# Altium project Project Board Module AM625.PrjPCB (part 2 of 2)

## Sheet SOC-Bootstrap.SchDoc
size A3; DocumentNumber: 9; SheetNumber: 10; SheetTotal: 14
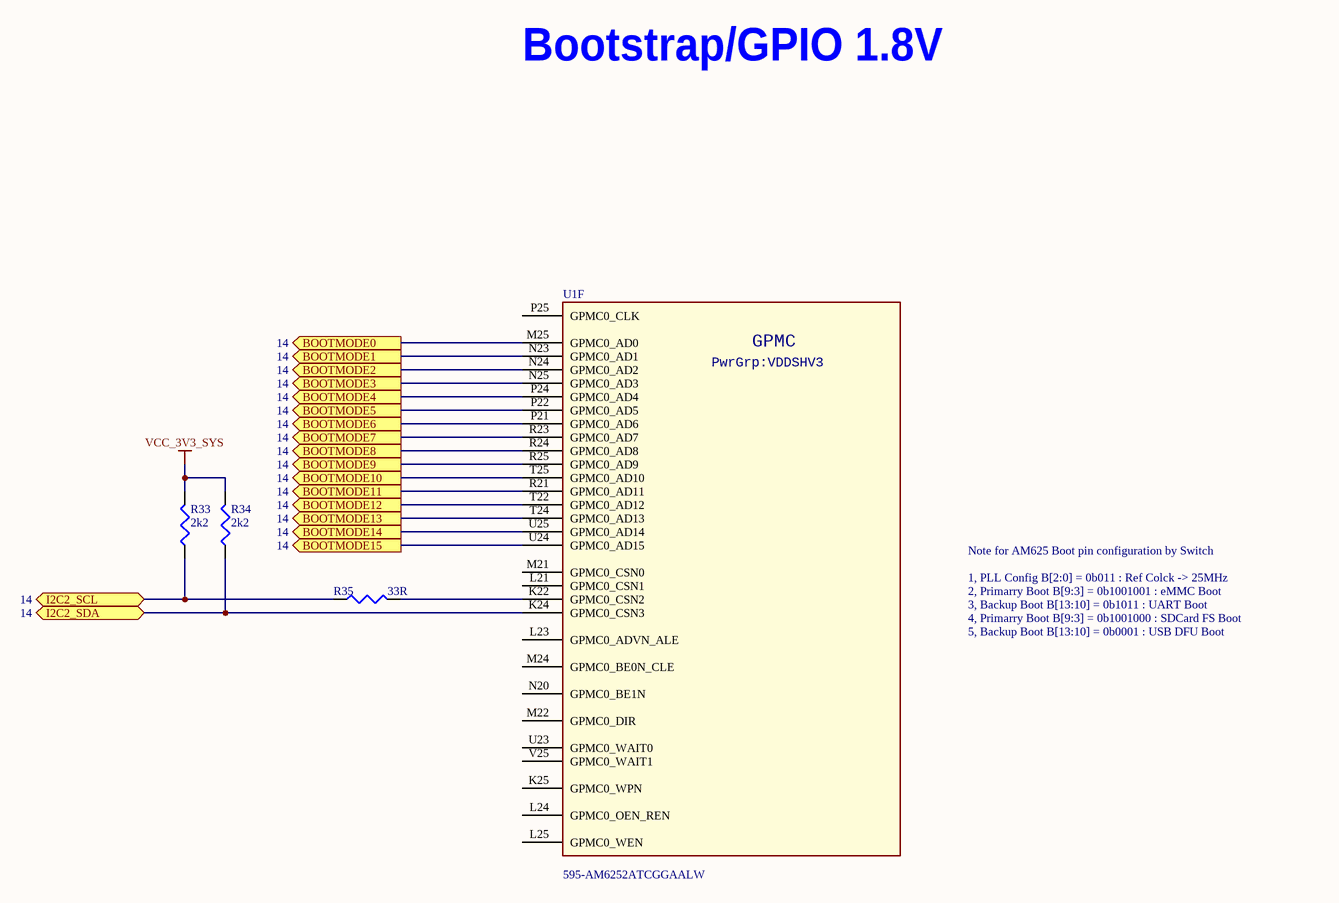
[diagram p5: SOC-Bootstrap.SchDoc]

### Parts
R33  2k2  [R0402]
R34  2k2  [R0402]
R35  33R  [R0201]
U1  Supplier Part Number 1: 595-AM6252ATCGGAALW  [BGA425C50P25X25_1300X1300X89]  (hidden comment: AM62-EVM_BGA425)  (part F of 18)

### Ports
BOOTMODE0 (out, see 14), BOOTMODE1 (out, see 14), BOOTMODE2 (out, see 14), BOOTMODE3 (out, see 14), BOOTMODE4 (out, see 14), BOOTMODE5 (out, see 14), BOOTMODE6 (out, see 14), BOOTMODE7 (out, see 14), BOOTMODE8 (out, see 14), BOOTMODE9 (out, see 14), BOOTMODE10 (out, see 14), BOOTMODE11 (out, see 14), BOOTMODE12 (out, see 14), BOOTMODE13 (out, see 14), BOOTMODE14 (out, see 14), BOOTMODE15 (out, see 14), I2C2_SCL (bidir, see 14), I2C2_SDA (bidir, see 14)

### Nets
VCC_3V3_SYS: R33.2 R34.2
BOOTMODE0: U1.M25(GPMC0_AD0) ; port BOOTMODE0
BOOTMODE1: U1.N23(GPMC0_AD1) ; port BOOTMODE1
BOOTMODE2: U1.N24(GPMC0_AD2) ; port BOOTMODE2
BOOTMODE3: U1.N25(GPMC0_AD3) ; port BOOTMODE3
BOOTMODE4: U1.P24(GPMC0_AD4) ; port BOOTMODE4
BOOTMODE5: U1.P22(GPMC0_AD5) ; port BOOTMODE5
BOOTMODE6: U1.P21(GPMC0_AD6) ; port BOOTMODE6
BOOTMODE7: U1.R23(GPMC0_AD7) ; port BOOTMODE7
BOOTMODE8: U1.R24(GPMC0_AD8) ; port BOOTMODE8
BOOTMODE9: U1.R25(GPMC0_AD9) ; port BOOTMODE9
BOOTMODE10: U1.T25(GPMC0_AD10) ; port BOOTMODE10
BOOTMODE11: U1.R21(GPMC0_AD11) ; port BOOTMODE11
BOOTMODE12: U1.T22(GPMC0_AD12) ; port BOOTMODE12
BOOTMODE13: U1.T24(GPMC0_AD13) ; port BOOTMODE13
BOOTMODE14: U1.U25(GPMC0_AD14) ; port BOOTMODE14
BOOTMODE15: U1.U24(GPMC0_AD15) ; port BOOTMODE15
I2C2_SCL: R33.1 R35.1 ; port I2C2_SCL
I2C2_SDA: R34.1 U1.K24(GPMC0_CSN3) ; port I2C2_SDA
NetR35_2: R35.2 U1.K22(GPMC0_CSN2)

Not connected (* = marked no-connect by the designer): U1 K25(GPMC0_WPN) L21(GPMC0_CSN1) L23(GPMC0_ADVN_ALE) L24(GPMC0_OEN_REN) L25(GPMC0_WEN) M21(GPMC0_CSN0) M22(GPMC0_DIR) M24(GPMC0_BE0N_CLE) N20(GPMC0_BE1N) P25(GPMC0_CLK) U23(GPMC0_WAIT0) V25(GPMC0_WAIT1)

### Notes on the sheet
- Bootstrap/GPIO 1.8V
- Note for AM625 Boot pin configuration by Switch
- 1, PLL Config B[2:0] = 0b011 : Ref Colck -> 25MHz
- 2, Primarry Boot B[9:3] = 0b1001001 : eMMC Boot
- 3, Backup Boot B[13:10] = 0b1011 : UART Boot
- 4, Primarry Boot B[9:3] = 0b1001000 : SDCard FS Boot
- 5, Backup Boot B[13:10] = 0b0001 : USB DFU Boot
- (in symbol AM62-EVM_BGA425, part F) GPMC; PwrGrp:VDDSHV3

### Library data of the parts
R33 R34 = RC0402FR-072K2L: RES 2.20K OHM 1/16W 1% 0402 SMD; Manufacturer: Yageo; Resistance (Ohms): 2.2K; Power (Watts): 0.063W, 1/16W; .Checked PCB: used; Temperature Coefficient: ±100ppm/°C; Category: Resistors; Supplier Part Number: 311-2.20KLRCT-ND; Manufacturer Part Number: RC0402FR-072K2L; Package / Case: 0402 (1005 Metric); Price 1k [$]: 0.01421; Tolerance: ±1%; Value: 2k2; .Checked SCH: used; Supplier: Digikey; Supplier 1: Digi-Key; Supplier Part Number 1: 311-2.20KLRCT-ND; RoHS: RoHS Compliant; Stock 1: 195154; Pricing 1: 10=0.014, 50=0.0104, 100=0.0079, 250=0.00584, 500=0.00432, 1000=0.00288 (USD); Composition: Thick Film; Features: -; Size / Dimension: 0.039" L x 0.020" W (1.00mm x 0.50mm); Height: 0.016" (0.40mm); Number of Terminations: 2; Packaging: Cut Tape (CT); ComponentLink1URL: http://www.yageo.com/documents/recent/PYu-RC0402_51_RoHS_L_6.pdf; ComponentLink1Description: http://www.yageo.com/documents/recent/PYu-RC0402_51_RoHS_L_6.pdf
R35 = RC0201FR-0733RL: RES 33 OHM 1% 1/20W 0201; Manufacturer: Yageo; Power Rating: 50mW; Voltage Rating: 25V; Temperature Coefficient: 200ppm/°C; Supplier 1: Digi-Key; Manufacturer Part Number: RC0201FR-0733RL; Stock 1: 4610000; Pricing 1: 10000=0.0053, 50000=0.0042, 100000=0.0038 (USD); Case/Package: 0201; Case Code (Metric): 0603; Case Code (Imperial): 0201; Size Code: 0201; Min Operating Temperature: -55°C; Max Operating Temperature: 125°C; Resistance: 33R; Tolerance: 1%; Package Quantity: 1; Packaging: Cut Tape; Resistor Type: Thick Film; Number of Terminations: 2; Termination: SMD/SMT; Max Power Dissipation: 50mW; Features: Moisture Resistant; Series: RC; Resistance Tolerance: 1%; Length: 0.024inch; Width: 0.012inch; Height: 0.01inch; Lead Free: Lead Free; RoHS Compliant: Yes; ComponentLink1URL: https://datasheet.ciiva.com/7672/1563626-7672223.pdf?src-supplier=Element14; ComponentLink1Description: https://datasheet.ciiva.com/7672/1563626-7672223.pdf?src-supplier=Element14; ComponentLink2URL: https://datasheet.ciiva.com/22698/1563626-22698520.pdf?src-supplier=Element14; ComponentLink2Description: https://datasheet.ciiva.com/22698/1563626-22698520.pdf?src-supplier=Element14; ComponentLink3URL: https://datasheet.ciiva.com/2560/pyu-r-int-thick-7-2560878.pdf?src-supplier=Digi-Key; ComponentLink3Description: https://datasheet.ciiva.com/2560/pyu-r-int-thick-7-2560878.pdf?src-supplier=Digi-Key; ComponentLink4URL: https://datasheet.ciiva.com/2560/pyu-r-int-thick-7-2560879.pdf?src-supplier=Digi-Key; ComponentLink4Description: https://datasheet.ciiva.com/2560/pyu-r-int-thick-7-2560879.pdf?src-supplier=Digi-Key; ComponentLink5URL: https://datasheet.ciiva.com/2560/pyu-r-int-thick-7-2560877.pdf?src-supplier=Digi-Key; ComponentLink5Description: https://datasheet.ciiva.com/2560/pyu-r-int-thick-7-2560877.pdf?src-supplier=Digi-Key; Supplier Part Number 1: 311-33.0MTR-ND
U1 = AM62-EVM_BGA425: ARM® Cortex®-A53 Microprocessor IC Sitara™ 2 Core, 64-Bit 1.4GHz 425-FCCSP (13x13); Manufacturer: Texas Instruments; Manufacturer Part Number: AM6252ATCGGAALW; Supplier 1: Mouser; Stock 1: 0; Pricing 1: 1=21.23, 10=19.58, 50=18.7, 100=18.7, 1000=15.94, 10000=15.94 (USD)

## Sheet eMMC FLASH INTERFACE.SchDoc
size A3; DocumentNumber: 5; SheetNumber: 6; SheetTotal: 14
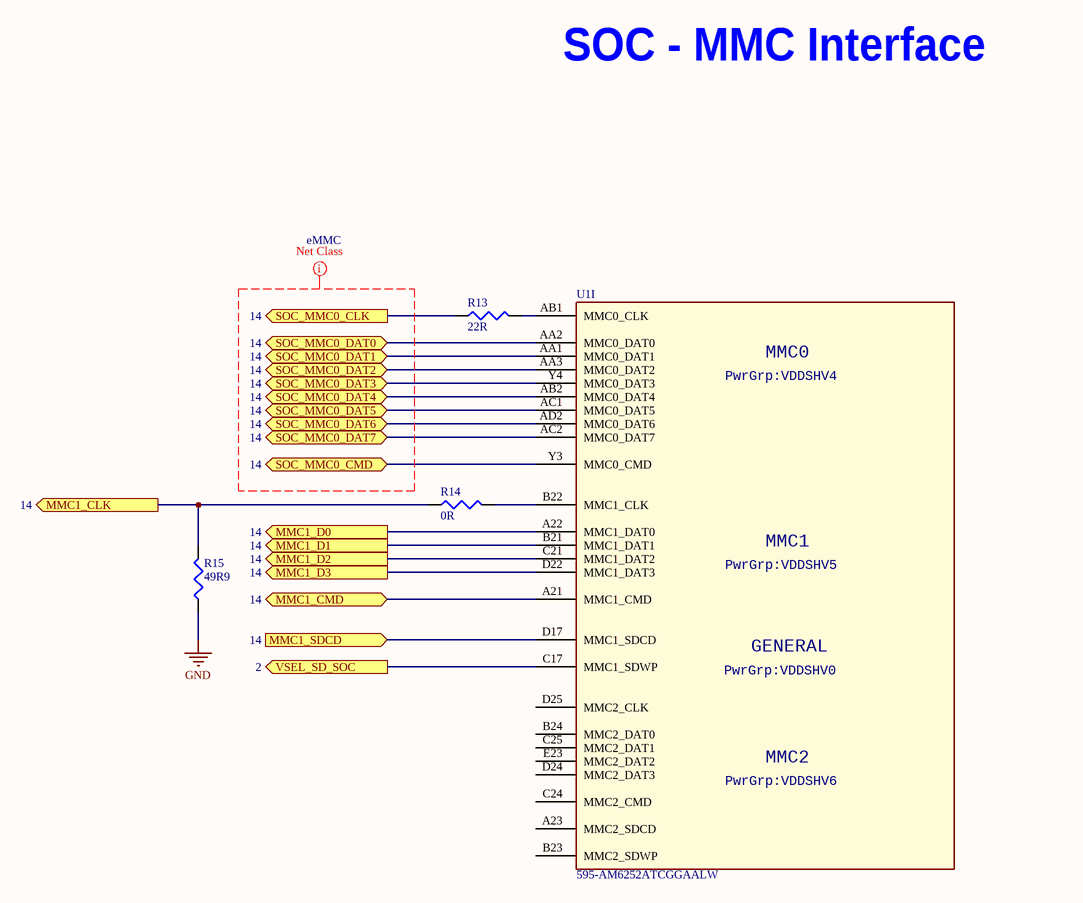
[diagram p6: eMMC FLASH INTERFACE.SchDoc]

### Parts
R13  22R  [R0402]
R14  0R  [R0402]
R15  49R9  [R0402]
U1  Supplier Part Number 1: 595-AM6252ATCGGAALW  [BGA425C50P25X25_1300X1300X89]  (hidden comment: AM62-EVM_BGA425)  (part I of 18)

### Ports
MMC1_CLK (out, see 14), MMC1_CMD (bidir, see 14), MMC1_D0 (out, see 14), MMC1_D1 (out, see 14), MMC1_D2 (out, see 14), MMC1_D3 (out, see 14), MMC1_SDCD (in, see 14), SOC_MMC0_CLK (out, see 14), SOC_MMC0_CMD (bidir, see 14), SOC_MMC0_DAT0 (bidir, see 14), SOC_MMC0_DAT1 (bidir, see 14), SOC_MMC0_DAT2 (bidir, see 14), SOC_MMC0_DAT3 (bidir, see 14), SOC_MMC0_DAT4 (bidir, see 14), SOC_MMC0_DAT5 (bidir, see 14), SOC_MMC0_DAT6 (bidir, see 14), SOC_MMC0_DAT7 (bidir, see 14), VSEL_SD_SOC (out, see 2)

### Nets
GND: R15.1
MMC1_CLK: R14.1 R15.2 ; port MMC1_CLK
MMC1_CMD: U1.A21(MMC1_CMD) ; port MMC1_CMD
MMC1_D0: U1.A22(MMC1_DAT0) ; port MMC1_D0
MMC1_D1: U1.B21(MMC1_DAT1) ; port MMC1_D1
MMC1_D2: U1.C21(MMC1_DAT2) ; port MMC1_D2
MMC1_D3: U1.D22(MMC1_DAT3) ; port MMC1_D3
MMC1_SDCD: U1.D17(MMC1_SDCD) ; port MMC1_SDCD
SOC_MMC0_CLK: R13.1 ; port SOC_MMC0_CLK
SOC_MMC0_CMD: U1.Y3(MMC0_CMD) ; port SOC_MMC0_CMD
SOC_MMC0_DAT0: U1.AA2(MMC0_DAT0) ; port SOC_MMC0_DAT0
SOC_MMC0_DAT1: U1.AA1(MMC0_DAT1) ; port SOC_MMC0_DAT1
SOC_MMC0_DAT2: U1.AA3(MMC0_DAT2) ; port SOC_MMC0_DAT2
SOC_MMC0_DAT3: U1.Y4(MMC0_DAT3) ; port SOC_MMC0_DAT3
SOC_MMC0_DAT4: U1.AB2(MMC0_DAT4) ; port SOC_MMC0_DAT4
SOC_MMC0_DAT5: U1.AC1(MMC0_DAT5) ; port SOC_MMC0_DAT5
SOC_MMC0_DAT6: U1.AD2(MMC0_DAT6) ; port SOC_MMC0_DAT6
SOC_MMC0_DAT7: U1.AC2(MMC0_DAT7) ; port SOC_MMC0_DAT7
VSEL_SD_SOC: U1.C17(MMC1_SDWP) ; port VSEL_SD_SOC
NetR13_2: R13.2 U1.AB1(MMC0_CLK)
NetR14_2: R14.2 U1.B22(MMC1_CLK)

Not connected (* = marked no-connect by the designer): U1 A23(MMC2_SDCD) B23(MMC2_SDWP) B24(MMC2_DAT0) C24(MMC2_CMD) C25(MMC2_DAT1) D24(MMC2_DAT3) D25(MMC2_CLK) E23(MMC2_DAT2)

### Layout directives
net class eMMC: (no net found under the mark)

### Notes on the sheet
- SOC - MMC Interface
- (in symbol AM62-EVM_BGA425, part I) MMC0; PwrGrp:VDDSHV4; MMC1; PwrGrp:VDDSHV5; GENERAL; PwrGrp:VDDSHV0; MMC2; PwrGrp:VDDSHV6

### Library data of the parts
R13 = RC0402FR-0722RL: RES 22.0 OHM 1/16W 1% 0402 SMD; Manufacturer: Yageo; Resistance (Ohms): 22; Power (Watts): 0.063W, 1/16W; .Checked PCB: used; Temperature Coefficient: ±100ppm/°C; Category: Resistors; Supplier Part Number: 311-22.0LRCT-ND; Manufacturer Part Number: RC0402FR-0722RL; Package / Case: 0402 (1005 Metric); Price 1k [$]: 0.01421; Tolerance: ±1%; Value: 22R; .Checked SCH: used; Supplier: Digikey; Supplier 1: Digi-Key; Supplier Part Number 1: 311-22.0LRCT-ND; RoHS: RoHS Compliant; Stock 1: 943800; Pricing 1: 10=0.014, 50=0.0104, 100=0.0079, 250=0.00584, 500=0.00432, 1000=0.00288 (USD); Composition: Thick Film; Features: -; Size / Dimension: 0.039" L x 0.020" W (1.00mm x 0.50mm); Height: 0.016" (0.40mm); Number of Terminations: 2; Packaging: Cut Tape (CT); ComponentLink1URL: http://www.yageo.com/documents/recent/PYu-RC0402_51_RoHS_L_6.pdf; ComponentLink1Description: http://www.yageo.com/documents/recent/PYu-RC0402_51_RoHS_L_6.pdf
R14 = RC0402JR-070RL: RES 0.0 OHM 1/16W 0402 SMD; Manufacturer: Yageo; Resistance (Ohms): 0.0; Power (Watts): 0.063W, 1/16W; Tolerance: Jumper; .Checked PCB: used; Category: Resistors; Supplier Part Number: 311-0.0JRCT-ND; Manufacturer Part Number: RC0402JR-070RL; Package / Case: 0402 (1005 Metric); Price 1k [$]: 0.01389; Value: 0R; .Checked SCH: used; Supplier: Digikey; Supplier 1: Digi-Key; Supplier Part Number 1: 311-0.0JRCT-ND; RoHS: RoHS Compliant; Stock 1: 1106330; Pricing 1: 10=0.012, 50=0.009, 100=0.0069, 250=0.00512, 500=0.0038, 1000=0.00253 (USD); Composition: Thick Film; Features: -; Temperature Coefficient: -; Size / Dimension: 0.039" L x 0.020" W (1.00mm x 0.50mm); Height: 0.016" (0.40mm); Number of Terminations: 2; Packaging: Cut Tape (CT); ComponentLink1URL: http://www.yageo.com/documents/recent/PYu-RC0402_51_RoHS_L_6.pdf; ComponentLink1Description: http://www.yageo.com/documents/recent/PYu-RC0402_51_RoHS_L_6.pdf
R15 = RC0402FR-0749R9L: RES 49.9 OHM 1/16W 1% 0402 SMD; Manufacturer: Yageo; Resistance (Ohms): 49.9; Power (Watts): 0.063W, 1/16W; Value: 49.9R; .Checked PCB: used; Temperature Coefficient: ±100ppm/°C; Category: Resistors; Supplier Part Number: 311-49.9LRCT-ND; Manufacturer Part Number: RC0402FR-0749R9L; Package / Case: 0402 (1005 Metric); Price 1k [$]: 0.01421; Tolerance: ±1%; .Checked SCH: used; Supplier: Digikey; Supplier 1: Digi-Key; Supplier Part Number 1: 311-49.9LRCT-ND; RoHS: RoHS Compliant; Stock 1: 235950; Pricing 1: 10=0.014, 50=0.0104, 100=0.0079, 250=0.00584, 500=0.00432, 1000=0.00288 (USD); Composition: Thick Film; Features: -; Size / Dimension: 0.039" L x 0.020" W (1.00mm x 0.50mm); Height: 0.016" (0.40mm); Number of Terminations: 2; Packaging: Cut Tape (CT); ComponentLink1URL: http://www.yageo.com/documents/recent/PYu-RC0402_51_RoHS_L_6.pdf; ComponentLink1Description: http://www.yageo.com/documents/recent/PYu-RC0402_51_RoHS_L_6.pdf
U1 = AM62-EVM_BGA425: as U1 on sheet SOC-Bootstrap; Supplier 1: Mouser; Stock 1: 0; Pricing 1: 1=21.23, 10=19.58, 50=18.7, 100=18.7, 1000=15.94, 10000=15.94 (USD)

## Sheet DDR4 Interface.SchDoc
size A2; DocumentNumber: 4; SheetNumber: 4; SheetTotal: 14
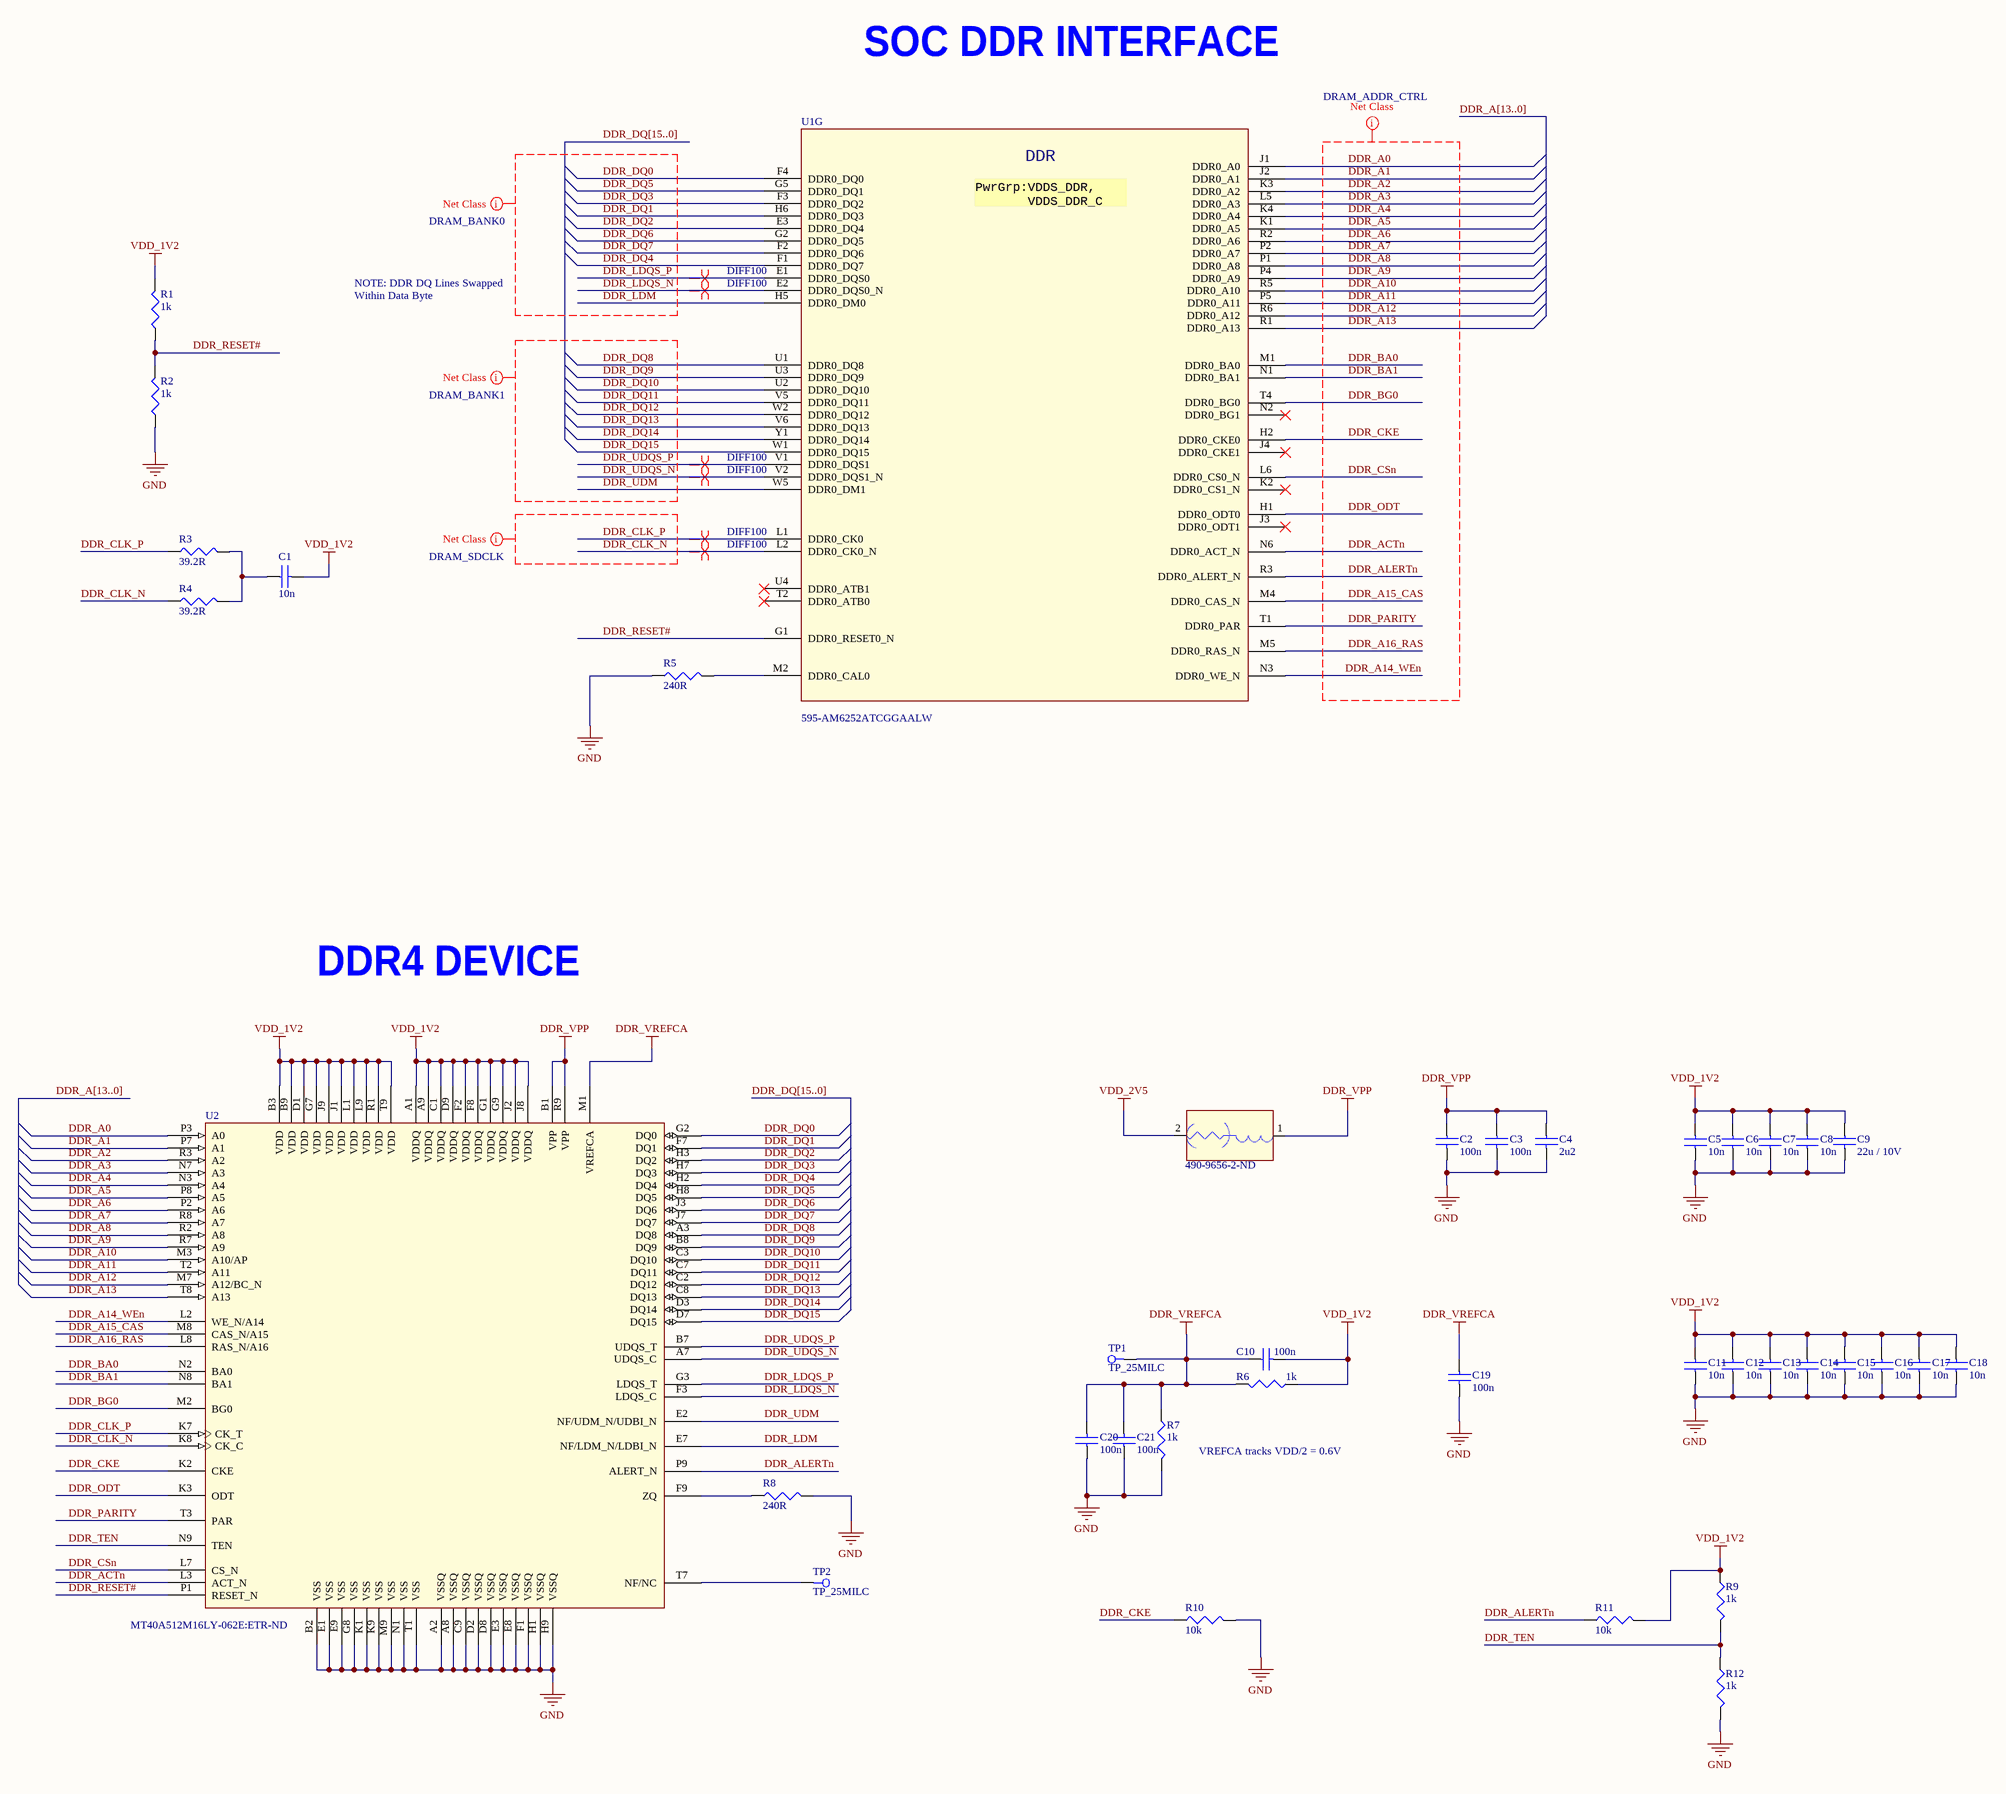
[diagram p7: DDR4 Interface.SchDoc]

### Parts
C1  10n  [C0201]
C2  100n  [C0201]
C3  100n  [C0201]
C4  2u2  [C0402]
C5  10n  [C0201]
C6  10n  [C0201]
C7  10n  [C0201]
C8  10n  [C0201]
C9  22u / 10V  [C0603]
C10  100n  [C0201]
C11  10n  [C0201]
C12  10n  [C0201]
C13  10n  [C0201]
C14  10n  [C0201]
C15  10n  [C0201]
C16  10n  [C0201]
C17  10n  [C0201]
C18  10n  [C0201]
C19  100n  [C0201]
C20  100n  [C0201]
C21  100n  [C0201]
FL1  Supplier Part Number 1: 490-9656-2-ND  [NFZ15SG152SN10B]  (hidden comment: BLM15PX121SN1D)
R1  1k  [R0201]
R2  1k  [R0201]
R3  39.2R  [R0402]
R4  39.2R  [R0402]
R5  240R  [R0201]
R6  1k  [R0201]
R7  1k  [R0201]
R8  240R  [R0402]
R9  1k  [R0201]
R10  10k  [R0201]
R11  10k  [R0201]
R12  1k  [R0201]
TP1  TP_25MILC  [TP_25C]  (no BOM)
TP2  TP_25MILC  [TP_25C]  (no BOM)
U1  Supplier Part Number 1: 595-AM6252ATCGGAALW  [BGA425C50P25X25_1300X1300X89]  (hidden comment: AM62-EVM_BGA425)  (part G of 18)
U2  Supplier Part Number 1: MT40A512M16LY-062E:ETR-ND  [BGA96C80P9X16_750X1350X120]  (hidden comment: MT40A512M16LY_FBGA96)

### Nets
DDR_VPP: C2.1 C3.1 C4.1 FL1.1 U2.B1(VPP) U2.R9(VPP)
DDR_VREFCA: C10.1 C19.1 C20.2 C21.2 R6.2 R7.1 TP1.1 U2.M1(VREFCA)
GND: C2.2 C3.2 C4.2 C5.1 C6.1 C7.1 C8.1 C9.2 C11.1 C12.1 C13.1 C14.1 C15.1 C16.1 C17.1 C18.1 C19.2 C20.1 C21.1 R2.1 R5.1 R7.2 R8.2 R10.2 R12.2 U2.A2(VSSQ) U2.A8(VSSQ) U2.B2(VSS) U2.C9(VSSQ) U2.D2(VSSQ) U2.D8(VSSQ) U2.E1(VSS) U2.E3(VSSQ) U2.E8(VSSQ) U2.E9(VSS) U2.F1(VSSQ) U2.G8(VSS) U2.H1(VSSQ) U2.H9(VSSQ) U2.K1(VSS) U2.K9(VSS) U2.M9(VSS) U2.N1(VSS) U2.T1(VSS)
VDD_1V2: C1.2 C5.2 C6.2 C7.2 C8.2 C9.1 C10.2 C11.2 C12.2 C13.2 C14.2 C15.2 C16.2 C17.2 C18.2 R1.2 R6.1 R9.1 R11.2 U2.A1(VDDQ) U2.A9(VDDQ) U2.B3(VDD) U2.B9(VDD) U2.C1(VDDQ) U2.D1(VDD) U2.D9(VDDQ) U2.F2(VDDQ) U2.F8(VDDQ) U2.G1(VDDQ) U2.G7(VDD) U2.G9(VDDQ) U2.J1(VDD) U2.J2(VDDQ) U2.J8(VDDQ) U2.J9(VDD) U2.L1(VDD) U2.L9(VDD) U2.R1(VDD) U2.T9(VDD)
VDD_2V5: FL1.2
DDR_A0: U1.J1(DDR0_A0) U2.P3(A0)
DDR_A1: U1.J2(DDR0_A1) U2.P7(A1)
DDR_A2: U1.K3(DDR0_A2) U2.R3(A2)
DDR_A3: U1.L5(DDR0_A3) U2.N7(A3)
DDR_A4: U1.K4(DDR0_A4) U2.N3(A4)
DDR_A5: U1.K1(DDR0_A5) U2.P8(A5)
DDR_A6: U1.R2(DDR0_A6) U2.P2(A6)
DDR_A7: U1.P2(DDR0_A7) U2.R8(A7)
DDR_A8: U1.P1(DDR0_A8) U2.R2(A8)
DDR_A9: U1.P4(DDR0_A9) U2.R7(A9)
DDR_A10: U1.R5(DDR0_A10) U2.M3(A10/AP)
DDR_A11: U1.P5(DDR0_A11) U2.T2(A11)
DDR_A12: U1.R6(DDR0_A12) U2.M7(A12/BC_N)
DDR_A13: U1.R1(DDR0_A13) U2.T8(A13)
DDR_A14_WEn: U1.N3(DDR0_WE_N) U2.L2(WE_N/A14)
DDR_A15_CAS: U1.M4(DDR0_CAS_N) U2.M8(CAS_N/A15)
DDR_A16_RAS: U1.M5(DDR0_RAS_N) U2.L8(RAS_N/A16)
DDR_ACTn: U1.N6(DDR0_ACT_N) U2.L3(ACT_N)
DDR_ALERTn: R11.1 U1.R3(DDR0_ALERT_N) U2.P9(ALERT_N)
DDR_BA0: U1.M1(DDR0_BA0) U2.N2(BA0)
DDR_BA1: U1.N1(DDR0_BA1) U2.N8(BA1)
DDR_BG0: U1.T4(DDR0_BG0) U2.M2(BG0)
DDR_CKE: R10.1 U1.H2(DDR0_CKE0) U2.K2(CKE)
DDR_CLK_N: R4.1 U1.L2(DDR0_CK0_N) U2.K8(CK_C)
DDR_CLK_P: R3.1 U1.L1(DDR0_CK0) U2.K7(CK_T)
DDR_CSn: U1.L6(DDR0_CS0_N) U2.L7(CS_N)
DDR_DQ0: U1.F4(DDR0_DQ0) U2.G2(DQ0)
DDR_DQ1: U1.H6(DDR0_DQ3) U2.F7(DQ1)
DDR_DQ2: U1.E3(DDR0_DQ4) U2.H3(DQ2)
DDR_DQ3: U1.F3(DDR0_DQ2) U2.H7(DQ3)
DDR_DQ4: U1.F1(DDR0_DQ7) U2.H2(DQ4)
DDR_DQ5: U1.G5(DDR0_DQ1) U2.H8(DQ5)
DDR_DQ6: U1.G2(DDR0_DQ5) U2.J3(DQ6)
DDR_DQ7: U1.F2(DDR0_DQ6) U2.J7(DQ7)
DDR_DQ8: U1.U1(DDR0_DQ8) U2.A3(DQ8)
DDR_DQ9: U1.U3(DDR0_DQ9) U2.B8(DQ9)
DDR_DQ10: U1.U2(DDR0_DQ10) U2.C3(DQ10)
DDR_DQ11: U1.V5(DDR0_DQ11) U2.C7(DQ11)
DDR_DQ12: U1.W2(DDR0_DQ12) U2.C2(DQ12)
DDR_DQ13: U1.V6(DDR0_DQ13) U2.C8(DQ13)
DDR_DQ14: U1.Y1(DDR0_DQ14) U2.D3(DQ14)
DDR_DQ15: U1.W1(DDR0_DQ15) U2.D7(DQ15)
DDR_LDM: U1.H5(DDR0_DM0) U2.E7(NF/LDM_N/LDBI_N)
DDR_LDQS_N: U1.E2(DDR0_DQS0_N) U2.F3(LDQS_C)
DDR_LDQS_P: U1.E1(DDR0_DQS0) U2.G3(LDQS_T)
DDR_ODT: U1.H1(DDR0_ODT0) U2.K3(ODT)
DDR_PARITY: U1.T1(DDR0_PAR) U2.T3(PAR)
DDR_RESET#: R1.1 R2.2 U1.G1(DDR0_RESET0_N) U2.P1(RESET_N)
DDR_TEN: R9.2 R12.1 U2.N9(TEN)
DDR_UDM: U1.W5(DDR0_DM1) U2.E2(NF/UDM_N/UDBI_N)
DDR_UDQS_N: U1.V2(DDR0_DQS1_N) U2.A7(UDQS_C)
DDR_UDQS_P: U1.V1(DDR0_DQS1) U2.B7(UDQS_T)
NetC1_1: C1.1 R3.2 R4.2
NetR5_2: R5.2 U1.M2(DDR0_CAL0)
NetR8_1: R8.1 U2.F9(ZQ)
NetTP2_1: TP2.1 U2.T7(NF/NC)

Not connected (* = marked no-connect by the designer): U1 J3(DDR0_ODT1)* J4(DDR0_CKE1)* K2(DDR0_CS1_N)* N2(DDR0_BG1)* T2(DDR0_ATB0)* U4(DDR0_ATB1)*

### Buses and harness runs
bus DDR_A[13..0]
bus DDR_DQ[15..0]

### Layout directives
net class DRAM_BANK0: DDR_DQ0, DDR_DQ1, DDR_DQ2, DDR_DQ3, DDR_DQ4, DDR_DQ5, DDR_DQ6, DDR_DQ7, DDR_LDM, DDR_LDQS_N, DDR_LDQS_P
net class DRAM_BANK1: DDR_DQ8, DDR_DQ9, DDR_DQ10, DDR_DQ11, DDR_DQ12, DDR_DQ13, DDR_DQ14, DDR_DQ15, DDR_UDM, DDR_UDQS_N, DDR_UDQS_P
net class DRAM_SDCLK: DDR_CLK_N, DDR_CLK_P
net class DRAM_ADDR_CTRL: DDR_A0, DDR_A1, DDR_A2, DDR_A3, DDR_A4, DDR_A5, DDR_A6, DDR_A7, DDR_A8, DDR_A9, DDR_A10, DDR_A11, DDR_A12, DDR_A13, DDR_A14_WEn, DDR_A15_CAS, DDR_A16_RAS, DDR_ACTn, DDR_ALERTn, DDR_BA0, DDR_BA1, DDR_BG0, DDR_CKE, DDR_CSn, DDR_ODT, DDR_PARITY
differential pair; net class DIFF100: DDR_CLK_N, DDR_CLK_P, DDR_LDQS_N, DDR_LDQS_P, DDR_UDQS_N, DDR_UDQS_P

### Notes on the sheet
- SOC DDR INTERFACE
- NOTE: DDR DQ Lines Swapped
- Within Data Byte
- DDR4 DEVICE
- (near R7) VREFCA tracks VDD/2 = 0.6V
- (in symbol AM62-EVM_BGA425, part G) DDR; PwrGrp:VDDS_DDR, / VDDS_DDR_C

### Library data of the parts
C1 C5-C8 C11-C18 = C0603X5R1C103K030BA: CAP CER .01UF 16V 10% X5R 0201; Manufacturer: TDK Corporation; Capacitance: 10000pF; .Creator: MM; Supplier 1: Digi-Key; Manufacturer Part Number: C0603X5R1C103K030BA; RoHS: RoHS Compliant; Category: Capacitors; Stock 1: 24793; Pricing 1: 1=0.1, 10=0.043, 100=0.0196, 250=0.01608, 500=0.01374, 1000=0.0105, 5000=0.00875 (USD); Packaging: Cut Tape (CT); Tolerance: ±10%; Voltage - Rated: 16V; Temperature Coefficient: X5R; Mounting Type: Surface Mount, MLCC; Operating Temperature: -55°C ~ 85°C; Applications: General Purpose; Ratings: -; Package / Case: 0201 (0603 Metric); Size / Dimension: 0.024" L x 0.012" W (0.60mm x 0.30mm); Height - Seated (Max): -; Thickness (Max): 0.013" (0.33mm); Lead Spacing: -; Features: -; Lead Style: -; ComponentLink1URL: http://product.tdk.com/en/catalog/datasheets/mlcc_commercial_general_en.pdf; ComponentLink1Description: http://product.tdk.com/en/catalog/datasheets/mlcc_commercial_general_en.pdf; Supplier Part Number 1: 445-16166-1-ND; .Checked PCB: MM; .Checked SCH: MM
C2 C3 C10 C19-C21 = C0603X5R1C104K030BC: CAP CER 0.1UF 16V 10% X5R 0201; Manufacturer: TDK Corporation; Capacitance: 0.1µF; .Creator: MM; Supplier 1: Digi-Key; Manufacturer Part Number: C0603X5R1C104K030BC; RoHS: RoHS Compliant; Category: Capacitors; Stock 1: 19491; Pricing 1: 1=0.1, 10=0.046, 100=0.0209, 250=0.01712, 500=0.01464, 1000=0.0114, 5000=0.0095 (USD); Packaging: Cut Tape (CT); Tolerance: ±10%; Voltage - Rated: 16V; Temperature Coefficient: X5R; Mounting Type: Surface Mount, MLCC; Operating Temperature: -55°C ~ 85°C; Applications: General Purpose; Ratings: -; Package / Case: 0201 (0603 Metric); Size / Dimension: 0.024" L x 0.012" W (0.60mm x 0.30mm); Height - Seated (Max): -; Thickness (Max): 0.013" (0.33mm); Lead Spacing: -; Features: -; Lead Style: -; ComponentLink1URL: http://product.tdk.com/en/catalog/datasheets/mlcc_commercial_general_en.pdf; ComponentLink1Description: http://product.tdk.com/en/catalog/datasheets/mlcc_commercial_general_en.pdf; Supplier Part Number 1: 445-7313-1-ND; .Checked PCB: MM; .Checked SCH: MM
C4 = C1005X5R1A225K: CAP CER 2.2UF 10V 10% X5R 0402; Manufacturer: TDK Corporation; Capacitance: 2.2µF; .Checked PCB: used; Supplier 1: Digi-Key; Supplier Part Number 1: 445-7392-1-ND; Manufacturer Part Number: C1005X5R1A225K; RoHS: RoHS Compliant; Category: Capacitors; Stock 1: 22891; Pricing 1: 1=0.42, 10=0.332, 100=0.2, 250=0.15, 500=0.128, 1000=0.1 (USD); Voltage - Rated: 10V; Tolerance: ±10%; Temperature Coefficient: X5R; Mounting Type: Surface Mount, MLCC; Operating Temperature: -55°C ~ 85°C; Applications: General Purpose; Ratings: -; Package / Case: 0402 (1005 Metric); Size / Dimension: 0.039" L x 0.020" W (1.00mm x 0.50mm); Height - Seated (Max): -; Thickness (Max): 0.022" (0.55mm); Lead Spacing: -; Features: -; Packaging: Cut Tape (CT); Lead Style: -; ComponentLink1URL: http://www.tdk.com/pdf/general_B11.pdf; ComponentLink1Description: http://www.tdk.com/pdf/general_B11.pdf; .Checked SCH: used
C9 = C1608X5R1A226M080AC: CAP CER 22UF 10V X5R 0603; Manufacturer: TDK Corporation; Capacitance: 22µF; Tolerance: ±20%; .Creator: MM; Supplier 1: Digi-Key; Manufacturer Part Number: C1608X5R1A226M080AC; RoHS: RoHS Compliant; Category: Capacitors; Stock 1: 405620; Pricing 1: 1=0.49, 10=0.469, 100=0.2275, 250=0.189, 500=0.1715, 1000=0.1575 (USD); Packaging: Cut Tape (CT); Voltage - Rated: 10V; Temperature Coefficient: X5R; Mounting Type: Surface Mount, MLCC; Operating Temperature: -55°C ~ 85°C; Applications: General Purpose; Ratings: -; Package / Case: 0603 (1608 Metric); Size / Dimension: 0.063" L x 0.031" W (1.60mm x 0.80mm); Height - Seated (Max): -; Thickness (Max): 0.035" (0.90mm); Lead Spacing: -; Features: -; Lead Style: -; ComponentLink1URL: http://product.tdk.com/en/catalog/datasheets/mlcc_commercial_general_en.pdf; ComponentLink1Description: http://product.tdk.com/en/catalog/datasheets/mlcc_commercial_general_en.pdf; Supplier Part Number 1: 445-9077-1-ND; .Checked SCH: MM; .Checked PCB: MM
FL1 = BLM15PX121SN1D: FERRITE BEAD 120 OHM 0402 1LN; Manufacturer: Murata; Tolerance: 25%; Impedance: 120R; Current Rating: 2A; Number of Lines: 1; DC Resistance (DCR): 55mR; Test Frequency: 100MHz; Supplier 1: Digi-Key; Manufacturer Part Number: BLM15PX121SN1D; Stock 1: 490000; Pricing 1: 10000=0.0196 (USD); Case/Package: 0402; Number of Pins: 2; Case Code (Metric): 1005; Case Code (Imperial): 0402; Weight: 2.3E-05oz; Material: Steel; Min Operating Temperature: -55°C; Max Operating Temperature: 125°C; Package Quantity: 1; Packaging: Tape and Reel; Max Current Rating: 2A; Termination: SMD/SMT; Max DC Current: 2A; Number of Circuits: 1; Series: EMIFIL®, BLM15P; Length: 1mm; Width: 0.5mm; Height: 0.5mm; Reach SVHC Compliant: Yes; Lead Free: Lead Free; RoHS Compliant: Yes; ComponentLink1URL: https://datasheet.ciiva.com/41449/001172210-da-01-en-drossel-0402-120r-1-0x0-5mm-10000st-41449498.pdf?src-supplier=Conrad; ComponentLink1Description: https://datasheet.ciiva.com/41449/001172210-da-01-en-drossel-0402-120r-1-0x0-5mm-10000st-41449498.pdf?src-supplier=Conrad; ComponentLink2URL: https://datasheet.ciiva.com/41860/l0110e-41860699.pdf?src-supplier=Digi-Key; ComponentLink2Description: https://datasheet.ciiva.com/41860/l0110e-41860699.pdf?src-supplier=Digi-Key; ComponentLink3URL: https://datasheet.ciiva.com/29364/l0110e-29364069.pdf?src-supplier=Digi-Key; ComponentLink3Description: https://datasheet.ciiva.com/29364/l0110e-29364069.pdf?src-supplier=Digi-Key
R1 R2 R6 R7 R9 R12 = RC0201FR-071KL: RES 1K OHM 1/20W 1% 0201 SMD; Manufacturer: Yageo; Power (Watts): 0.05W, 1/20W; Temperature Coefficient: ±200ppm/°C; .Creator: MM; Supplier 1: Digi-Key; Manufacturer Part Number: RC0201FR-071KL; RoHS: RoHS Compliant; Category: Resistors; Stock 1: 0; Pricing 1: 1=0.1, 10=0.074, 25=0.054, 100=0.0303, 250=0.02312, 500=0.0185, 1000=0.01361, 2500=0.01182, 5000=0.00976 (USD); Packaging: Cut Tape (CT); Resistance (Ohms): 1k; Tolerance: ±1%; Composition: Thick Film; Features: Moisture Resistant; Package / Case: 0201 (0603 Metric); Supplier Device Package: 0201; Size / Dimension: 0.024" L x 0.012" W (0.60mm x 0.30mm); Height: 0.010" (0.26mm); Number of Terminations: 2; ComponentLink1URL: http://www.yageo.com/documents/recent/PYu-RC0201_51_RoHS_L_8.pdf; ComponentLink1Description: http://www.yageo.com/documents/recent/PYu-RC0201_51_RoHS_L_8.pdf; Supplier Part Number 1: 311-1KMCT-ND; .Checked PCB: MM; .Checked SCH: MM
R3 R4 = RMCF0402FT39R2: RES 39.2 OHM 1% 1/16W 0402; Manufacturer: Stackpole Electronics; Max Power Dissipation: 63mW; Temperature Coefficient: 100ppm/°C; Supplier 1: Digi-Key; Manufacturer Part Number: RMCF0402FT39R2; Stock 1: 220000; Pricing 1: 10000=0.0028, 20000=0.0025, 30000=0.0023, 50000=0.0021, 100000=0.0019 (USD); Mount: Surface Mount; Case/Package: 0402; Case Code (Metric): 1005; Case Code (Imperial): 0402; Contact Plating: Tin,Matte; Min Operating Temperature: -55°C; Max Operating Temperature: 155°C; Resistance: 39.2R; Tolerance: 1%; Packaging: Tape and Reel; Resistor Type: Thick Film; Number of Terminations: 2; Features: Automotive AEC-Q200; Series: RMCF; Length: 0.039inch; Width: 0.02inch; Height: 0.016inch; Radiation Hardening: No; Lead Free: Lead Free; RoHS Compliant: Yes; ComponentLink1URL: https://www.seielect.com/catalog/SEI-RMCF_RMCP.pdf?src-supplier=Avnet; ComponentLink1Description: https://www.seielect.com/catalog/SEI-RMCF_RMCP.pdf?src-supplier=Avnet; ComponentLink2URL: https://www.seielect.com/catalog/SEI-Packaging.pdf?src-supplier=Digi-Key; ComponentLink2Description: https://www.seielect.com/catalog/SEI-Packaging.pdf?src-supplier=Digi-Key; ComponentLink3URL: https://www.seielect.com/catalog/sei-rmcf_rmcp.pdf?src-supplier=Digi-Key; ComponentLink3Description: https://www.seielect.com/catalog/sei-rmcf_rmcp.pdf?src-supplier=Digi-Key; Supplier Part Number 1: RMCF0402FT39R2TR-ND
R5 = RMCF0201FT240R: RES 240 OHM 1/20W 1% 0201; Manufacturer: Stackpole Electronics Inc; Resistance (Ohms): 240; Power (Watts): 0.05W, 1/20W; Temperature Coefficient: ±200ppm/°C; .Creator: MM; Supplier 1: Digi-Key; Manufacturer Part Number: RMCF0201FT240R; RoHS: RoHS Compliant; Category: Resistors; Stock 1: 37080; Pricing 1: 1=0.12, 10=0.084, 50=0.046, 100=0.035, 250=0.026, 500=0.0192, 1000=0.0128, 2500=0.0108, 5000=0.009 (USD); Packaging: Cut Tape (CT); Tolerance: ±1%; Composition: Thick Film; Features: -; Package / Case: 0201 (0603 Metric); Supplier Device Package: 0201; Size / Dimension: 0.024" L x 0.012" W (0.60mm x 0.30mm); Height: 0.009" (0.24mm); Number of Terminations: 2; ComponentLink1URL: http://www.seielect.com/Catalog/SEI-RMCF_RMCP.pdf; ComponentLink1Description: http://www.seielect.com/Catalog/SEI-RMCF_RMCP.pdf; Supplier Part Number 1: RMCF0201FT240RCT-ND; .Checked PCB: MM; .Checked SCH: MM
R8 = RMCF0402FT240R: RES TF 240 OHM 1% 0.0625W 0402; Manufacturer: Stackpole Electronics Inc; Resistance (Ohms): 240; Power (Watts): 0.063W, 1/16W; .Checked PCB: used; Temperature Coefficient: ±100ppm/°C; Category: Resistors; Supplier Part Number: RMCF0402FT240RCT-ND; Manufacturer Part Number: RMCF0402FT240R; Package / Case: 0402 (1005 Metric); Price 1k [$]: 0.00384; Tolerance: ±1%; Value: 240R; .Checked SCH: used; Supplier: Digikey; Supplier 1: Digi-Key; Supplier Part Number 1: RMCF0402FT240RCT-ND; RoHS: RoHS Compliant; Stock 1: 39860; Pricing 1: 1=0.04, 10=0.025, 50=0.0138, 100=0.0105, 250=0.0078, 500=0.00576, 1000=0.00384 (USD); Composition: Thick Film; Features: -; Size / Dimension: 0.039" L x 0.020" W (1.00mm x 0.50mm); Height: 0.016" (0.40mm); Number of Terminations: 2; Packaging: Cut Tape (CT); ComponentLink1URL: http://www.seielect.com/Catalog/SEI-RMCF.pdf; ComponentLink1Description: http://www.seielect.com/Catalog/SEI-RMCF.pdf
R10 R11 = RC0201FR-0710KL: RES 10K OHM 1/20W 1% 0201 SMD; Manufacturer: Yageo; Power (Watts): 0.05W, 1/20W; Temperature Coefficient: ±200ppm/°C; .Creator: MM; Supplier 1: Digi-Key; Manufacturer Part Number: RC0201FR-0710KL; RoHS: RoHS Compliant; Category: Resistors; Stock 1: 529049; Pricing 1: 1=0.1, 10=0.074, 25=0.054, 100=0.0303, 250=0.02312, 500=0.0185, 1000=0.01361, 2500=0.01182, 5000=0.00976 (USD); Packaging: Cut Tape (CT); Resistance (Ohms): 10k; Tolerance: ±1%; Composition: Thick Film; Features: Moisture Resistant; Package / Case: 0201 (0603 Metric); Supplier Device Package: 0201; Size / Dimension: 0.024" L x 0.012" W (0.60mm x 0.30mm); Height: 0.010" (0.26mm); Number of Terminations: 2; ComponentLink1URL: http://www.yageo.com/documents/recent/PYu-RC0201_51_RoHS_L_8.pdf; ComponentLink1Description: http://www.yageo.com/documents/recent/PYu-RC0201_51_RoHS_L_8.pdf; Supplier Part Number 1: 311-10.0KMCT-ND; .Checked PCB: MM; .Checked SCH: MM
TP1 TP2 = TP_25MILC: Test Point 25mil
U1 = AM62-EVM_BGA425: as U1 on sheet SOC-Bootstrap; Supplier 1: Mouser; Stock 1: 0; Pricing 1: 1=21.23, 10=19.58, 50=18.7, 100=18.7, 1000=15.94, 10000=15.94 (USD)
U2 = MT40A512M16LY_FBGA96: SDRAM - DDR4 Memory IC 8Gbit Parallel 1.33 GHz 96-FBGA (7.5x13.5); Manufacturer: Micron Technology; Manufacturer Part Number: MT40A512M16LY-062E:E TR; Memory Type: Volatile; Memory Size: 8Gb; Frequency: 1.6GHz; Supplier 1: Digi-Key; Stock 1: 0; Pricing 1: 2000=5.4055 (USD); Mount: Surface Mount; Case/Package: TFBGA; Min Operating Temperature: 0°C; Max Operating Temperature: 95°C; Packaging: Tape and Reel; Series: -; ComponentLink1URL: https://www.micron.com/~/media/documents/products/data-sheet/dram/ddr4/8gb_ddr4_sdram.pdf?src-supplier=Digi-Key; ComponentLink1Description: https://www.micron.com/~/media/documents/products/data-sheet/dram/ddr4/8gb_ddr4_sdram.pdf?src-supplier=Digi-Key; ComponentLink2URL: https://datasheet.octopart.com/MT40A512M16LY-062E%3AE-TR-Micron-datasheet-163656737.pdf?src-supplier=SHENGYU+ELECTRONICShttps://datasheet.octopart.com/MT40A512M16LY-062E%3AE-TR-Micron-datasheet-163656737.pdf?src-supplier=SHENGYU+ELECTRONICS; ComponentLink2Description: https://datasheet.octopart.com/MT40A512M16LY-062E%3AE-TR-Micron-datasheet-163656737.pdf?src-supplier=SHENGYU+ELECTRONICS

## Sheet SOC POWER CAPS & SOC VSS.SchDoc
size A2; DocumentNumber: 3; SheetNumber: 4; SheetTotal: 14
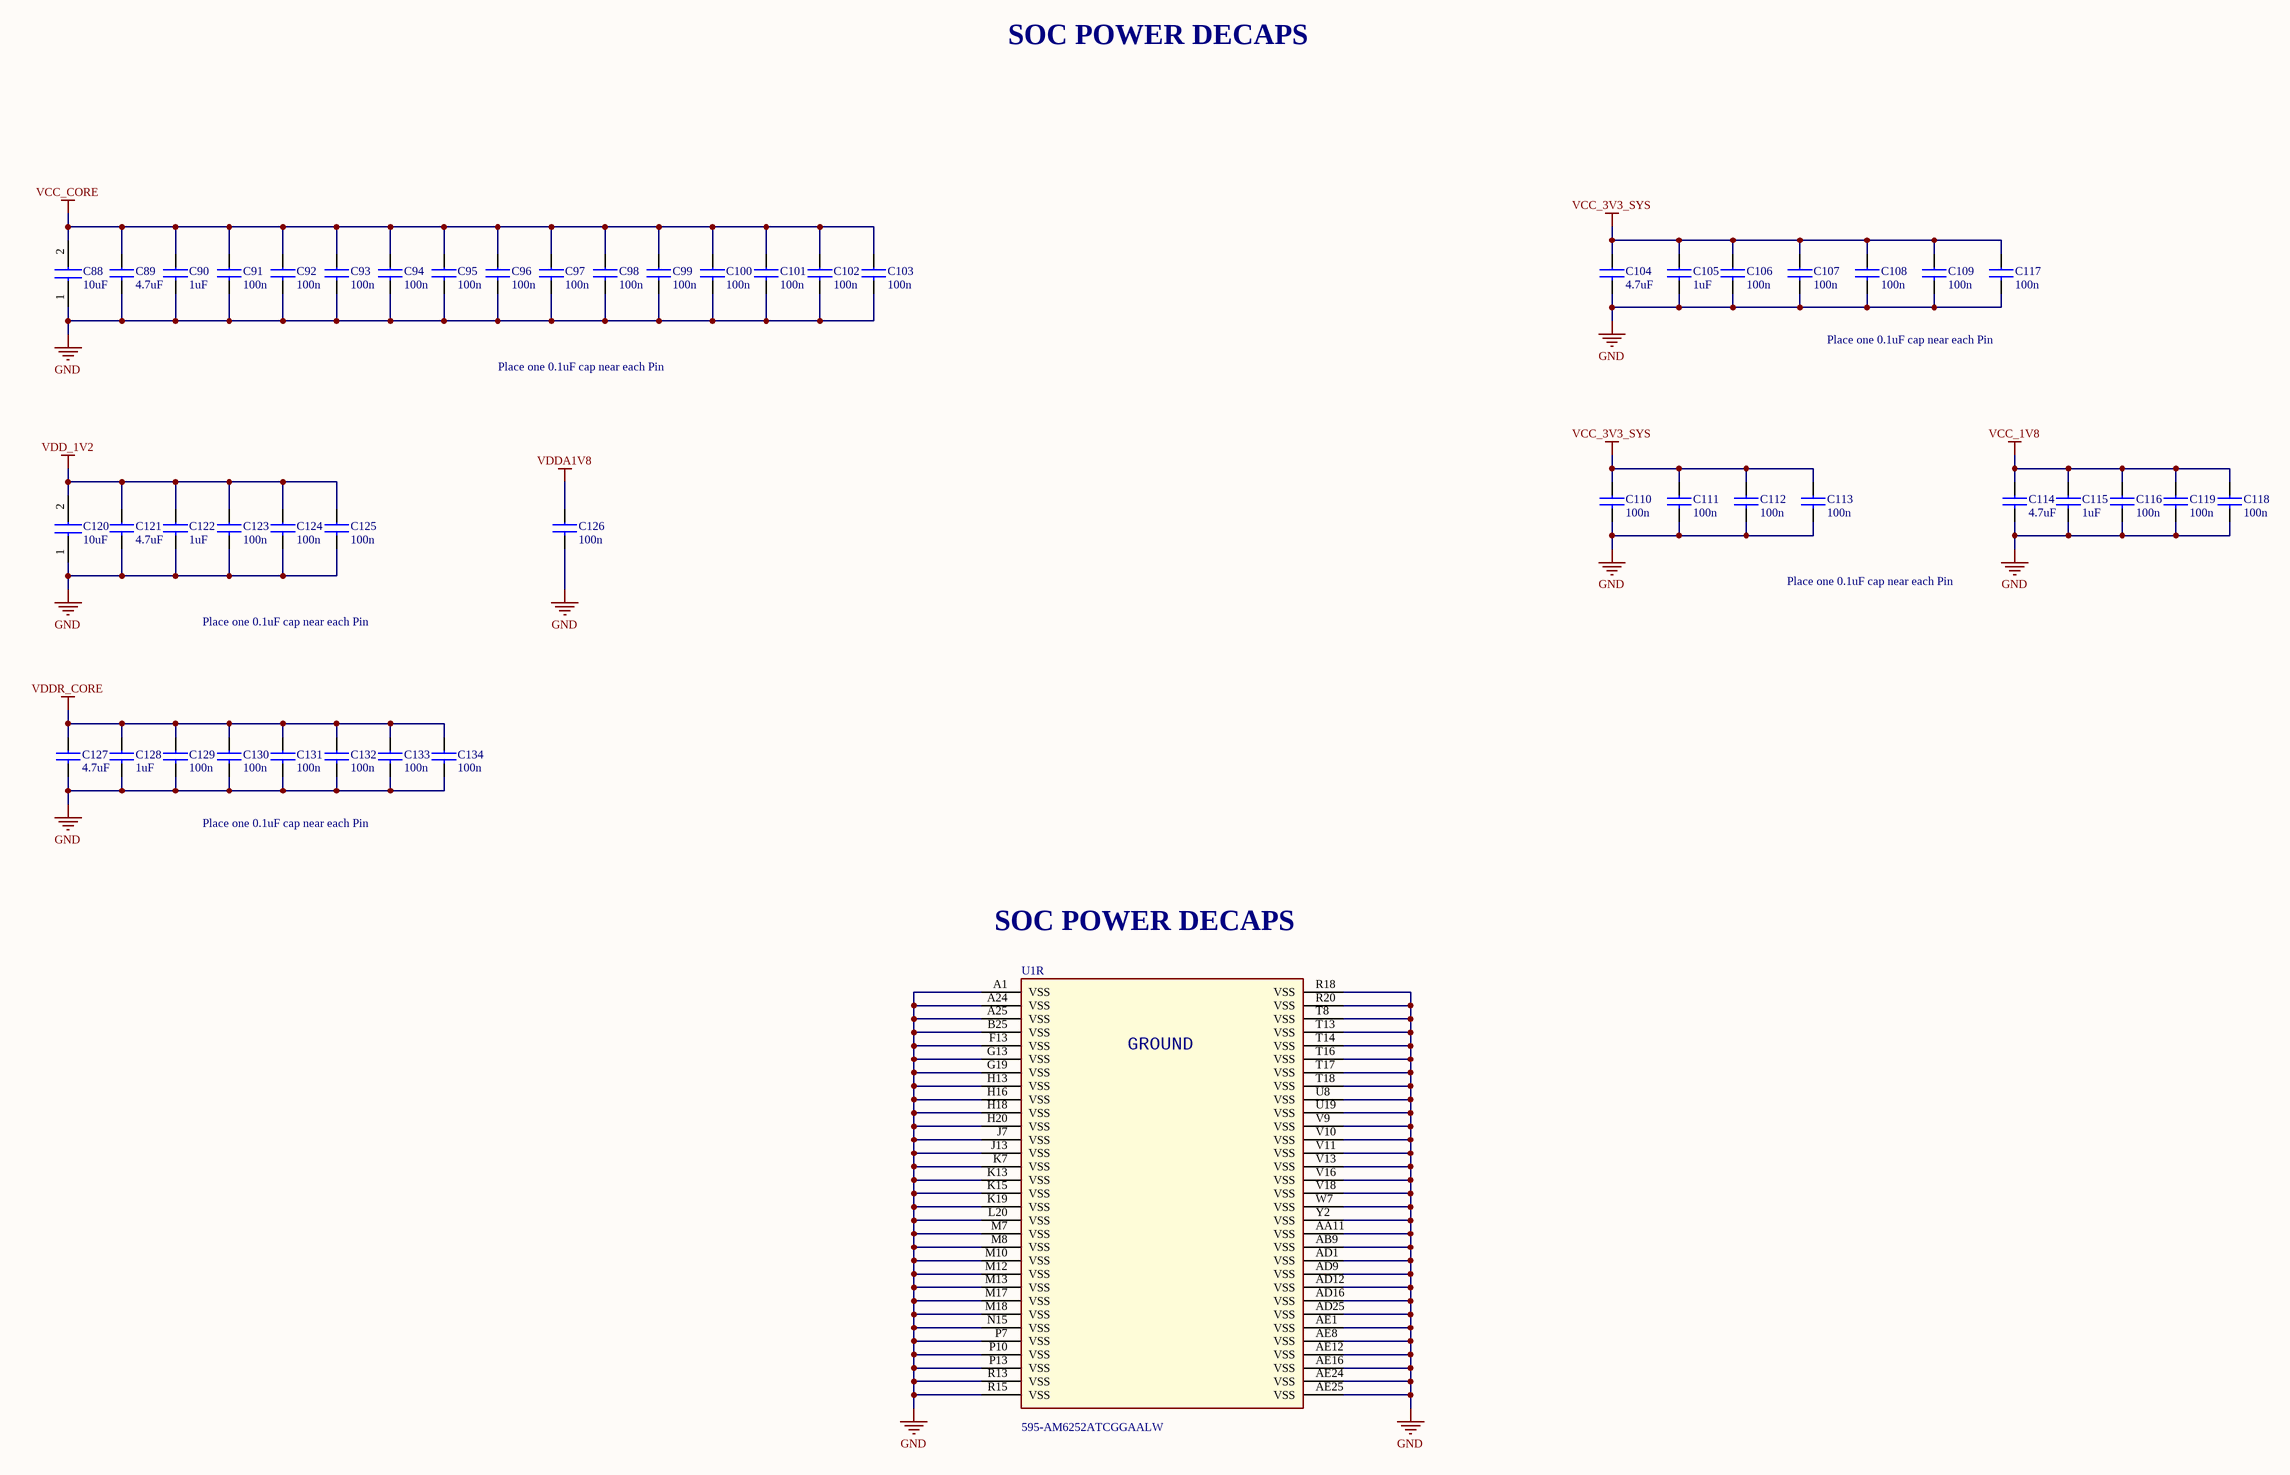
[diagram p8: SOC POWER CAPS & SOC VSS.SchDoc]

### Parts
C88  10uF  [C0603]
C89  4.7uF  [C0201]
C90  1uF  [C0201]
C91  100n  [C0201]
C92  100n  [C0201]
C93  100n  [C0201]
C94  100n  [C0201]
C95  100n  [C0201]
C96  100n  [C0201]
C97  100n  [C0201]
C98  100n  [C0201]
C99  100n  [C0201]
C100  100n  [C0201]
C101  100n  [C0201]
C102  100n  [C0201]
C103  100n  [C0201]
C104  4.7uF  [C0201]
C105  1uF  [C0201]
C106  100n  [C0201]
C107  100n  [C0201]
C108  100n  [C0201]
C109  100n  [C0201]
C110  100n  [C0201]
C111  100n  [C0201]
C112  100n  [C0201]
C113  100n  [C0201]
C114  4.7uF  [C0201]
C115  1uF  [C0201]
C116  100n  [C0201]
C117  100n  [C0201]
C118  100n  [C0201]
C119  100n  [C0201]
C120  10uF  [C0603]
C121  4.7uF  [C0201]
C122  1uF  [C0201]
C123  100n  [C0201]
C124  100n  [C0201]
C125  100n  [C0201]
C126  100n  [C0201]
C127  4.7uF  [C0201]
C128  1uF  [C0201]
C129  100n  [C0201]
C130  100n  [C0201]
C131  100n  [C0201]
C132  100n  [C0201]
C133  100n  [C0201]
C134  100n  [C0201]
U1  Supplier Part Number 1: 595-AM6252ATCGGAALW  [BGA425C50P25X25_1300X1300X89]  (hidden comment: AM62-EVM_BGA425)  (part R of 18)

### Nets
GND: C88.1 C89.2 C90.2 C91.2 C92.2 C93.2 C94.2 C95.2 C96.2 C97.2 C98.2 C99.2 C100.2 C101.2 C102.2 C103.2 C104.2 C105.2 C106.2 C107.2 C108.2 C109.2 C110.2 C111.2 C112.2 C113.2 C114.2 C115.2 C116.2 C117.2 C118.2 C119.2 C120.1 C121.2 C122.2 C123.2 C124.2 C125.2 C126.2 C127.2 C128.2 C129.2 C130.2 C131.2 C132.2 C133.2 C134.2 U1.A1(VSS) U1.A24(VSS) U1.A25(VSS) U1.AA11(VSS) U1.AB9(VSS) U1.AD1(VSS) U1.AD9(VSS) U1.AD12(VSS) U1.AD16(VSS) U1.AD25(VSS) U1.AE1(VSS) U1.AE8(VSS) U1.AE12(VSS) U1.AE16(VSS) U1.AE24(VSS) U1.AE25(VSS) U1.B25(VSS) U1.F13(VSS) U1.G13(VSS) U1.G19(VSS) U1.H13(VSS) U1.H16(VSS) U1.H18(VSS) U1.H20(VSS) U1.J7(VSS) U1.J13(VSS) U1.K7(VSS) U1.K13(VSS) U1.K15(VSS) U1.K19(VSS) U1.L20(VSS) U1.M7(VSS) U1.M8(VSS) U1.M10(VSS) U1.M12(VSS) U1.M13(VSS) U1.M17(VSS) U1.M18(VSS) U1.N15(VSS) U1.P7(VSS) U1.P10(VSS) U1.P13(VSS) U1.R13(VSS) U1.R15(VSS) U1.R18(VSS) U1.R20(VSS) U1.T8(VSS) U1.T13(VSS) U1.T14(VSS) U1.T16(VSS) U1.T17(VSS) U1.T18(VSS) U1.U8(VSS) U1.U19(VSS) U1.V9(VSS) U1.V10(VSS) U1.V11(VSS) U1.V13(VSS) U1.V16(VSS) U1.V18(VSS) U1.W7(VSS) U1.Y2(VSS)
VCC_1V8: C114.1 C115.1 C116.1 C118.1 C119.1
VCC_3V3_SYS: C104.1 C105.1 C106.1 C107.1 C108.1 C109.1 C110.1 C111.1 C112.1 C113.1 C117.1
VCC_CORE: C88.2 C89.1 C90.1 C91.1 C92.1 C93.1 C94.1 C95.1 C96.1 C97.1 C98.1 C99.1 C100.1 C101.1 C102.1 C103.1
VDD_1V2: C120.2 C121.1 C122.1 C123.1 C124.1 C125.1
VDDA1V8: C126.1
VDDR_CORE: C127.1 C128.1 C129.1 C130.1 C131.1 C132.1 C133.1 C134.1

### Notes on the sheet
- SOC POWER DECAPS
- Place one 0.1uF cap near each Pin
- (in symbol AM62-EVM_BGA425, part R) GROUND

### Library data of the parts
C88 C120 = CL10A106MQ8NNNC: 10 µF ±20% 6.3V Ceramic Capacitor X5R 0603 (1608 Metric); Manufacturer_Name: SAMSUNG; Manufacturer Part Number: CL03A474KQ3NNNC; Capacitance: 470nF; Tolerance: 10%; Datasheet Link: http://uk.rs-online.com/web/p/products/7664718; Height: 0.9mm; Manufacturer_Part_Number: CL10A106MQ8NNNC; Mouser Part Number: 187-CL10A106MQ8NNNC; Mouser Price/Stock: https://www.mouser.co.uk/ProductDetail/Samsung-Electro-Mechanics/CL10A106MQ8NNNC?qs=349EhDEZ59qlB6a%2FjjeGAg%3D%3D; Arrow Part Number: CL10A106MQ8NNNC; Arrow Price/Stock: https://www.arrow.com/en/products/cl10a106mq8nnnc/samsung-electro-mechanics?region=nac; Manufacturer: Samsung; Mount: Surface Mount; Case/Package: 0201; Case Code (Metric): 0603; Case Code (Imperial): 0201; Min Operating Temperature: -55°C; Max Operating Temperature: 85°C; Package Quantity: 1; Packaging: Cut Tape; Voltage Rating: 6.3V; Series: CL; Voltage Rating (DC): 6.3V; Length: 0.024inch; Width: 0.012inch; Thickness: 0.013inch; RoHS Compliant: Yes; Lead Free: Lead Free; Supplier 1: Digi-Key; Stock 1: 2081153; Pricing 1: 1=0.11, 10=0.083, 50=0.0452, 100=0.0369, 500=0.0264, 1000=0.0207 (USD); Contact Plating: Tin; Dielectric: X5R; Voltage: 6.3V; Construction: Flat; Depth: 0.8mm; Radiation Hardening: No; ComponentLink1URL: https://datasheet.ciiva.com/25798/cl10a106mq8nnnc-25798320.pdf?src-supplier=Digi-Key; ComponentLink1Description: https://datasheet.ciiva.com/25798/cl10a106mq8nnnc-25798320.pdf?src-supplier=Digi-Key; ComponentLink2URL: https://datasheet.ciiva.com/26838/getdatasheetpartid-357557-26838347.pdf?src-supplier=Verical; ComponentLink2Description: https://datasheet.ciiva.com/26838/getdatasheetpartid-357557-26838347.pdf?src-supplier=Verical; ComponentLink3URL: https://datasheet.ciiva.com/16437/cl05b104kq5nnnc-16437327.pdf?src-supplier=Future+Electronics; ComponentLink3Description: https://datasheet.ciiva.com/16437/cl05b104kq5nnnc-16437327.pdf?src-supplier=Future+Electronics; Supplier Part Number 1: 1276-1119-6-ND
C89 C104 C114 C121 C127 = GRM035R60J475ME15D: CAP CER 4.7UF 6.3V X5R 0201; Manufacturer: Murata; Tolerance: 20%; Supplier 1: Digi-Key; Manufacturer Part Number: GRM035R60J475ME15D; Stock 1: 1730472; Pricing 1: 10000=0.044, 50000=0.0377, 100000=0.0333, 250000=0.0331 (USD); Mount: Surface Mount; Case/Package: 0201; Case Code (Metric): 0603; Case Code (Imperial): 0201; Min Operating Temperature: -55°C; Max Operating Temperature: 85°C; Packaging: Cut Tape; Series: GRM; Capacitance: 4.7uF; Voltage Rating: 6.3V; Voltage Rating (DC): 6.3V; Dielectric: X5R; Length: 0.024inch; Width: 0.012inch; Thickness: 0.022inch; RoHS Compliant: Yes; ComponentLink1URL: https://datasheet.octopart.com/GRM035R60J475ME15D-Murata-datasheet-140089765.pdf?src-supplier=Future+Electronics; ComponentLink1Description: https://datasheet.octopart.com/GRM035R60J475ME15D-Murata-datasheet-140089765.pdf?src-supplier=Future+Electronics; ComponentLink2URL: http://www.farnell.com/datasheets/2853106.pdf?src-supplier=Farnell; ComponentLink2Description: http://www.farnell.com/datasheets/2853106.pdf?src-supplier=Farnell; ComponentLink3URL: http://www.farnell.com/datasheets/2853106.pdf?src-supplier=Newark; ComponentLink3Description: http://www.farnell.com/datasheets/2853106.pdf?src-supplier=Newark; ComponentLink4URL: https://datasheet.octopart.com/GRM035R60J475ME15D-Murata-datasheet-149522819.pdf?src-supplier=Farnell; ComponentLink4Description: https://datasheet.octopart.com/GRM035R60J475ME15D-Murata-datasheet-149522819.pdf?src-supplier=Farnell; ComponentLink5URL: http://search.murata.co.jp/Ceramy/image/img/A01X/G101/ENG/GRM035R60J475ME15-01.pdf?src-supplier=Digi-Key; ComponentLink5Description: http://search.murata.co.jp/Ceramy/image/img/A01X/G101/ENG/GRM035R60J475ME15-01.pdf?src-supplier=Digi-Key; ComponentLink6URL: https://datasheet.octopart.com/GRM035R60J475ME15D-Murata-datasheet-165579666.pdf?src-supplier=TME; ComponentLink6Description: https://datasheet.octopart.com/GRM035R60J475ME15D-Murata-datasheet-165579666.pdf?src-supplier=TME; Supplier Part Number 1: 490-13230-2-ND
C90 C105 C115 C122 C128 = CL03A105KQ3CSNC: CAP CER 1UF 6.3V X5R 0201; Manufacturer: Samsung; Tolerance: 10%; Supplier 1: Digi-Key; Manufacturer Part Number: CL03A105KQ3CSNC; Stock 1: 1049900; Pricing 1: 10000=0.0226, 20000=0.0215, 30000=0.0204, 50000=0.0187, 100000=0.0154, 250000=0.0141 (USD); Mount: Surface Mount; Case/Package: 0201; Case Code (Metric): 0603; Case Code (Imperial): 0201; Contact Plating: Tin; Min Operating Temperature: -55°C; Max Operating Temperature: 85°C; Capacitance: 1uF; Packaging: Tape and Reel; Voltage Rating: 6.3V; Dielectric: X5R; Series: CL; Construction: Flat; Length: 0.6mm; Width: 0.012inch; Height: 0.3mm; Thickness: 0.013inch; Depth: 0.3mm; Radiation Hardening: No; RoHS Compliant: Yes; ComponentLink1URL: https://datasheet.ciiva.com/18699/cl03a105kq3csnc-18699129.pdf?src-supplier=Digi-Key; ComponentLink1Description: https://datasheet.ciiva.com/18699/cl03a105kq3csnc-18699129.pdf?src-supplier=Digi-Key; ComponentLink2URL: https://datasheet.ciiva.com/26838/getdatasheetpartid-355153-26838086.pdf?src-supplier=Verical; ComponentLink2Description: https://datasheet.ciiva.com/26838/getdatasheetpartid-355153-26838086.pdf?src-supplier=Verical; Supplier Part Number 1: 1276-1323-2-ND
C91-C103 C106-C113 C116-C119 C123-C126 C129-C134 = C0603X5R1C104K030BC: as C2 on sheet DDR4 Interface; Supplier 1: Digi-Key; Manufacturer Part Number: C0603X5R1C104K030BC; RoHS: RoHS Compliant; Category: Capacitors; Stock 1: 19491; Pricing 1: 1=0.1, 10=0.046, 100=0.0209, 250=0.01712, 500=0.01464, 1000=0.0114, 5000=0.0095 (USD); Packaging: Cut Tape (CT); Tolerance: ±10%; Voltage - Rated: 16V; Temperature Coefficient: X5R; Mounting Type: Surface Mount, MLCC; Operating Temperature: -55°C ~ 85°C; Applications: General Purpose; Ratings: -; Package / Case: 0201 (0603 Metric); Size / Dimension: 0.024" L x 0.012" W (0.60mm x 0.30mm); Height - Seated (Max): -; Thickness (Max): 0.013" (0.33mm); Lead Spacing: -; Features: -; Lead Style: -; ComponentLink1URL: http://product.tdk.com/en/catalog/datasheets/mlcc_commercial_general_en.pdf; ComponentLink1Description: http://product.tdk.com/en/catalog/datasheets/mlcc_commercial_general_en.pdf; Supplier Part Number 1: 445-7313-1-ND; .Checked PCB: MM; .Checked SCH: MM
U1 = AM62-EVM_BGA425: as U1 on sheet SOC-Bootstrap; Supplier 1: Mouser; Stock 1: 0; Pricing 1: 1=21.23, 10=19.58, 50=18.7, 100=18.7, 1000=15.94, 10000=15.94 (USD)

## Sheet SoC GPIO 3.3V.SchDoc
size A2; DocumentNumber: 11; SheetNumber: 12; SheetTotal: 14
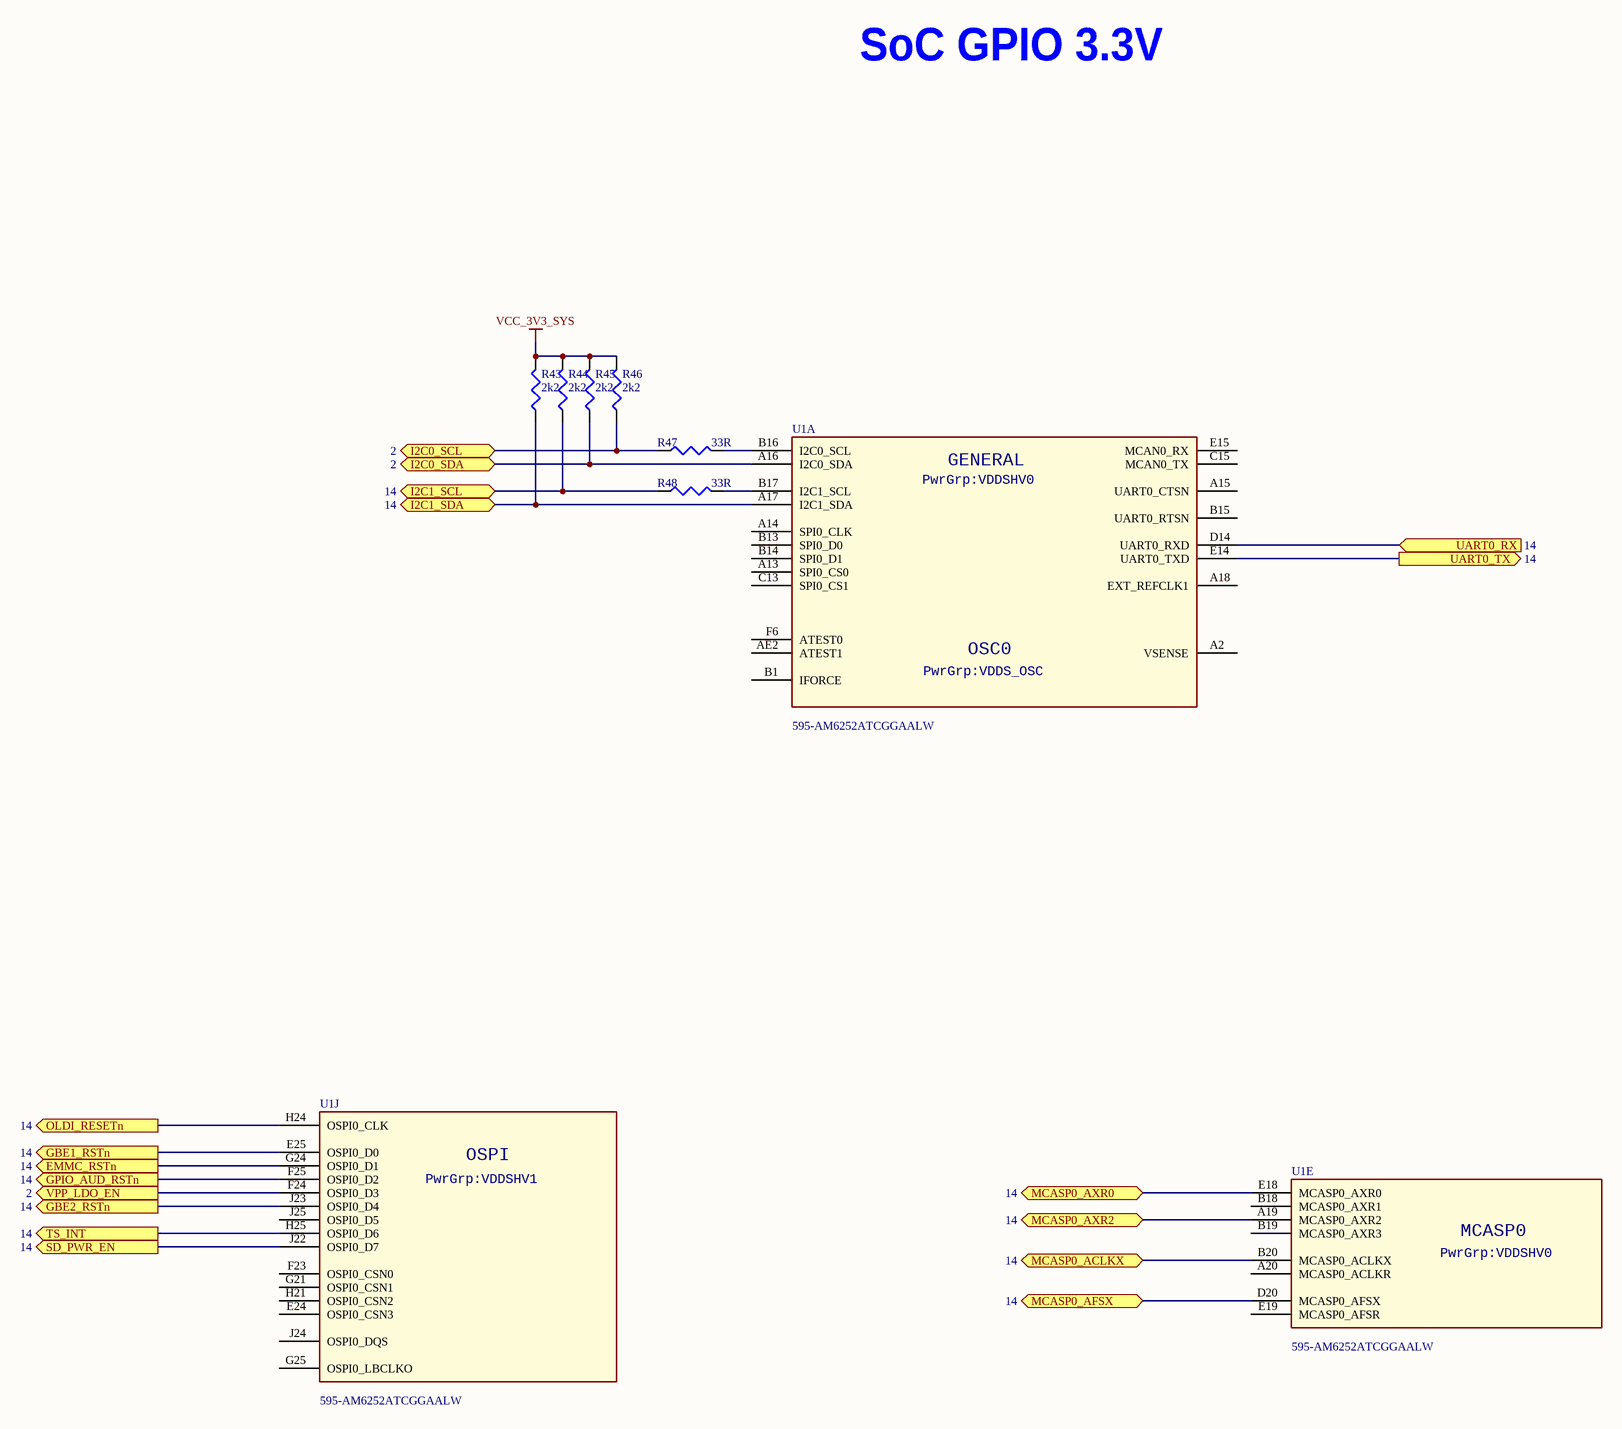
[diagram p9: SoC GPIO 3.3V.SchDoc]

### Parts
R43  2k2  [R0402]
R44  2k2  [R0402]
R45  2k2  [R0402]
R46  2k2  [R0402]
R47  33R  [R0201]
R48  33R  [R0201]
U1  Supplier Part Number 1: 595-AM6252ATCGGAALW  [BGA425C50P25X25_1300X1300X89]  (hidden comment: AM62-EVM_BGA425)  (parts A,E,J of 18)

### Ports
EMMC_RSTn (out, see 14), GBE1_RSTn (out, see 14), GBE2_RSTn (out, see 14), GPIO_AUD_RSTn (out, see 14), I2C0_SCL (bidir, see 2), I2C0_SDA (bidir, see 2), I2C1_SCL (bidir, see 14), I2C1_SDA (bidir, see 14), MCASP0_ACLKX (bidir, see 14), MCASP0_AFSX (bidir, see 14), MCASP0_AXR0 (bidir, see 14), MCASP0_AXR2 (bidir, see 14), OLDI_RESETn (out, see 14), SD_PWR_EN (out, see 14), TS_INT (out, see 14), UART0_RX (in, see 14), UART0_TX (out, see 14), VPP_LDO_EN (out, see 2)

### Nets
VCC_3V3_SYS: R43.2 R44.2 R45.2 R46.2
EMMC_RSTn: U1.G24(OSPI0_D1) ; port EMMC_RSTn
GBE1_RSTn: U1.E25(OSPI0_D0) ; port GBE1_RSTn
GBE2_RSTn: U1.J23(OSPI0_D4) ; port GBE2_RSTn
GPIO_AUD_RSTn: U1.F25(OSPI0_D2) ; port GPIO_AUD_RSTn
I2C0_SCL: R46.1 R47.1 ; port I2C0_SCL
I2C0_SDA: R45.1 U1.A16(I2C0_SDA) ; port I2C0_SDA
I2C1_SCL: R44.1 R48.1 ; port I2C1_SCL
I2C1_SDA: R43.1 U1.A17(I2C1_SDA) ; port I2C1_SDA
MCASP0_ACLKX: U1.B20(MCASP0_ACLKX) ; port MCASP0_ACLKX
MCASP0_AFSX: U1.D20(MCASP0_AFSX) ; port MCASP0_AFSX
MCASP0_AXR0: U1.E18(MCASP0_AXR0) ; port MCASP0_AXR0
MCASP0_AXR2: U1.A19(MCASP0_AXR2) ; port MCASP0_AXR2
OLDI_RESETn: U1.H24(OSPI0_CLK) ; port OLDI_RESETn
SD_PWR_EN: U1.J22(OSPI0_D7) ; port SD_PWR_EN
TS_INT: U1.H25(OSPI0_D6) ; port TS_INT
UART0_RX: U1.D14(UART0_RXD) ; port UART0_RX
UART0_TX: U1.E14(UART0_TXD) ; port UART0_TX
VPP_LDO_EN: U1.F24(OSPI0_D3) ; port VPP_LDO_EN
NetR47_2: R47.2 U1.B16(I2C0_SCL)
NetR48_2: R48.2 U1.B17(I2C1_SCL)

Not connected (* = marked no-connect by the designer): U1 A2(VSENSE) A13(SPI0_CS0) A14(SPI0_CLK) A15(UART0_CTSN) A18(EXT_REFCLK1) A20(MCASP0_ACLKR) AE2(ATEST1) B1(IFORCE) B13(SPI0_D0) B14(SPI0_D1) B15(UART0_RTSN) B18(MCASP0_AXR1) B19(MCASP0_AXR3) C13(SPI0_CS1) C15(MCAN0_TX) E15(MCAN0_RX) E19(MCASP0_AFSR) E24(OSPI0_CSN3) F6(ATEST0) F23(OSPI0_CSN0) G21(OSPI0_CSN1) G25(OSPI0_LBCLKO) H21(OSPI0_CSN2) J24(OSPI0_DQS) J25(OSPI0_D5)

### Notes on the sheet
- SoC GPIO 3.3V
- (in symbol AM62-EVM_BGA425, part A) GENERAL; PwrGrp:VDDSHV0; OSC0; PwrGrp:VDDS_OSC
- (in symbol AM62-EVM_BGA425, part E) MCASP0; PwrGrp:VDDSHV0
- (in symbol AM62-EVM_BGA425, part J) OSPI; PwrGrp:VDDSHV1

### Library data of the parts
R43-R46 = RC0402FR-072K2L: as R33 on sheet SOC-Bootstrap; Category: Resistors; Supplier Part Number: 311-2.20KLRCT-ND; Manufacturer Part Number: RC0402FR-072K2L; Package / Case: 0402 (1005 Metric); Price 1k [$]: 0.01421; Tolerance: ±1%; Value: 2k2; .Checked SCH: used; Supplier: Digikey; Supplier 1: Digi-Key; Supplier Part Number 1: 311-2.20KLRCT-ND; RoHS: RoHS Compliant; Stock 1: 195154; Pricing 1: 10=0.014, 50=0.0104, 100=0.0079, 250=0.00584, 500=0.00432, 1000=0.00288 (USD); Composition: Thick Film; Features: -; Size / Dimension: 0.039" L x 0.020" W (1.00mm x 0.50mm); Height: 0.016" (0.40mm); Number of Terminations: 2; Packaging: Cut Tape (CT); ComponentLink1URL: http://www.yageo.com/documents/recent/PYu-RC0402_51_RoHS_L_6.pdf; ComponentLink1Description: http://www.yageo.com/documents/recent/PYu-RC0402_51_RoHS_L_6.pdf
R47 R48 = RC0201FR-0733RL: as R35 on sheet SOC-Bootstrap; Supplier 1: Digi-Key; Manufacturer Part Number: RC0201FR-0733RL; Stock 1: 4610000; Pricing 1: 10000=0.0053, 50000=0.0042, 100000=0.0038 (USD); Case/Package: 0201; Case Code (Metric): 0603; Case Code (Imperial): 0201; Size Code: 0201; Min Operating Temperature: -55°C; Max Operating Temperature: 125°C; Resistance: 33R; Tolerance: 1%; Package Quantity: 1; Packaging: Cut Tape; Resistor Type: Thick Film; Number of Terminations: 2; Termination: SMD/SMT; Max Power Dissipation: 50mW; Features: Moisture Resistant; Series: RC; Resistance Tolerance: 1%; Length: 0.024inch; Width: 0.012inch; Height: 0.01inch; Lead Free: Lead Free; RoHS Compliant: Yes; ComponentLink1URL: https://datasheet.ciiva.com/7672/1563626-7672223.pdf?src-supplier=Element14; ComponentLink1Description: https://datasheet.ciiva.com/7672/1563626-7672223.pdf?src-supplier=Element14; ComponentLink2URL: https://datasheet.ciiva.com/22698/1563626-22698520.pdf?src-supplier=Element14; ComponentLink2Description: https://datasheet.ciiva.com/22698/1563626-22698520.pdf?src-supplier=Element14; ComponentLink3URL: https://datasheet.ciiva.com/2560/pyu-r-int-thick-7-2560878.pdf?src-supplier=Digi-Key; ComponentLink3Description: https://datasheet.ciiva.com/2560/pyu-r-int-thick-7-2560878.pdf?src-supplier=Digi-Key; ComponentLink4URL: https://datasheet.ciiva.com/2560/pyu-r-int-thick-7-2560879.pdf?src-supplier=Digi-Key; ComponentLink4Description: https://datasheet.ciiva.com/2560/pyu-r-int-thick-7-2560879.pdf?src-supplier=Digi-Key; ComponentLink5URL: https://datasheet.ciiva.com/2560/pyu-r-int-thick-7-2560877.pdf?src-supplier=Digi-Key; ComponentLink5Description: https://datasheet.ciiva.com/2560/pyu-r-int-thick-7-2560877.pdf?src-supplier=Digi-Key; Supplier Part Number 1: 311-33.0MTR-ND
U1 = AM62-EVM_BGA425: as U1 on sheet SOC-Bootstrap; Supplier 1: Mouser; Stock 1: 0; Pricing 1: 1=21.23, 10=19.58, 50=18.7, 100=18.7, 1000=15.94, 10000=15.94 (USD)

## Sheet USB_A & USB_C.SchDoc
size A3; DocumentNumber: 12; SheetNumber: 13; SheetTotal: 14
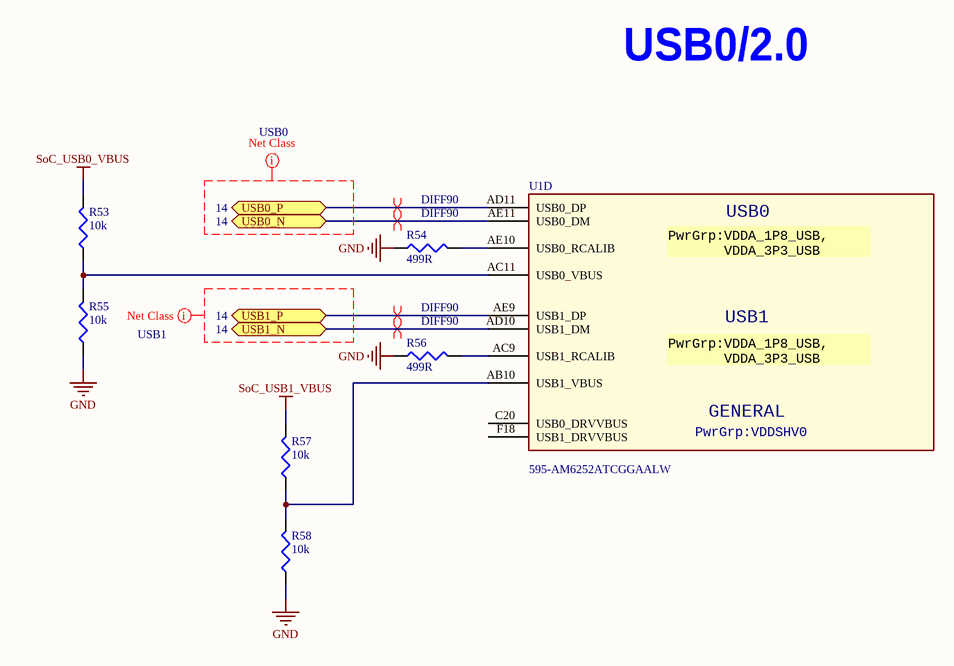
[diagram p10: USB_A & USB_C.SchDoc]

### Parts
R53  10k  [R0402]
R54  499R  [R0402]
R55  10k  [R0402]
R56  499R  [R0402]
R57  10k  [R0402]
R58  10k  [R0402]
U1  Supplier Part Number 1: 595-AM6252ATCGGAALW  [BGA425C50P25X25_1300X1300X89]  (hidden comment: AM62-EVM_BGA425)  (part D of 18)

### Ports
USB0_N (bidir, see 14), USB0_P (bidir, see 14), USB1_N (bidir, see 14), USB1_P (bidir, see 14)

### Nets
GND: R54.1 R55.1 R56.1 R58.1
SoC_USB0_VBUS: R53.2
SoC_USB1_VBUS: R57.2
USB0_N: U1.AE11(USB0_DM) ; port USB0_N
USB0_P: U1.AD11(USB0_DP) ; port USB0_P
USB1_N: U1.AD10(USB1_DM) ; port USB1_N
USB1_P: U1.AE9(USB1_DP) ; port USB1_P
NetR53_1: R53.1 R55.2 U1.AC11(USB0_VBUS)
NetR54_2: R54.2 U1.AE10(USB0_RCALIB)
NetR56_2: R56.2 U1.AC9(USB1_RCALIB)
NetR57_1: R57.1 R58.2 U1.AB10(USB1_VBUS)

Not connected (* = marked no-connect by the designer): U1 C20(USB0_DRVVBUS) F18(USB1_DRVVBUS)

### Layout directives
differential pair; net class DIFF90: USB0_N, USB0_P, USB1_N, USB1_P
net class USB0: (no net found under the mark)
net class USB1: (no net found under the mark)

### Notes on the sheet
- USB0/2.0
- (in symbol AM62-EVM_BGA425, part D) USB0; PwrGrp:VDDA_1P8_USB, / VDDA_3P3_USB; USB1; GENERAL; PwrGrp:VDDSHV0

### Library data of the parts
R53 R55 R57 R58 = RC0402FR-0710KL: RES 10.0K OHM 1/16W 1% 0402 SMD; Manufacturer: Yageo; Power (Watts): 0.063W, 1/16W; .Checked PCB: used; Temperature Coefficient: ±100ppm/°C; Category: Resistors; Supplier Part Number: 311-10.0KLRCT-ND; Manufacturer Part Number: RC0402FR-0710KL; Package / Case: 0402 (1005 Metric); Price 1k [$]: 0.01421; Resistance (Ohms): 10K; Tolerance: ±1%; Value: 10k; .Checked SCH: used; Supplier: Digikey; Supplier 1: Digi-Key; Supplier Part Number 1: 311-10.0KLRCT-ND; RoHS: RoHS Compliant; Stock 1: 2916495; Pricing 1: 10=0.014, 50=0.0104, 100=0.0079, 250=0.00584, 500=0.00432, 1000=0.00288 (USD); Composition: Thick Film; Features: -; Size / Dimension: 0.039" L x 0.020" W (1.00mm x 0.50mm); Height: 0.016" (0.40mm); Number of Terminations: 2; Packaging: Cut Tape (CT); ComponentLink1URL: http://www.yageo.com/documents/recent/PYu-RC0402_51_RoHS_L_6.pdf; ComponentLink1Description: http://www.yageo.com/documents/recent/PYu-RC0402_51_RoHS_L_6.pdf
R54 R56 = RT0402BRD07499RL: RES SMD 499 OHM 0.1% 1/16W 0402; Manufacturer: Yageo; Power Rating: 62.5mW; Voltage Rating: 50V; Max Power Dissipation: 63mW; Temperature Coefficient: 25ppm/°C; Supplier 1: Digi-Key; Manufacturer Part Number: RT0402BRD07499RL; Stock 1: 20000; Pricing 1: 10000=0.0411, 30000=0.0391, 50000=0.0383, 100000=0.0375 (USD); Case/Package: 0402; Case Code (Metric): 1005; Case Code (Imperial): 0402; Size Code: 0402; Min Operating Temperature: -55°C; Max Operating Temperature: 155°C; Package Quantity: 10000; Packaging: Tape and Reel; Resistance: 499R; Tolerance: 0.1%; Resistor Type: Thin Film; Number of Terminations: 2; Termination: SMD/SMT; Voltage Rating (DC): 50V; Features: Moisture Resistant; Series: RT; Length: 0.039inch; Width: 0.02inch; Height: 0.014inch; Lead Free: Lead Free; RoHS Compliant: Yes; ComponentLink1URL: https://datasheet.ciiva.com/12724/pyu-rt-1-to-0-05-rohs-l-4-12724797.pdf?src-supplier=Mouser; ComponentLink1Description: https://datasheet.ciiva.com/12724/pyu-rt-1-to-0-05-rohs-l-4-12724797.pdf?src-supplier=Mouser; ComponentLink2URL: https://datasheet.ciiva.com/2582/pyu-rt-1-to-0-05-rohs-l-4-2582397.pdf?src-supplier=Digi-Key; ComponentLink2Description: https://datasheet.ciiva.com/2582/pyu-rt-1-to-0-05-rohs-l-4-2582397.pdf?src-supplier=Digi-Key; ComponentLink3URL: https://datasheet.ciiva.com/46635/pyu-rt-1-to-0-05-rohs-l-5-46635222.pdf?src-supplier=Digi-Key; ComponentLink3Description: https://datasheet.ciiva.com/46635/pyu-rt-1-to-0-05-rohs-l-5-46635222.pdf?src-supplier=Digi-Key; Supplier Part Number 1: YAG1440TR-ND
U1 = AM62-EVM_BGA425: as U1 on sheet SOC-Bootstrap; Supplier 1: Mouser; Stock 1: 0; Pricing 1: 1=21.23, 10=19.58, 50=18.7, 100=18.7, 1000=15.94, 10000=15.94 (USD)

## Nets that join several sheets
GND: Power Manager (29 pins), eMMC FLASH INTERFACE (R15.1), DDR4 Interface (44 pins), SOC POWER CAPS & SOC VSS (109 pins), USB_A & USB_C (R54.1 R55.1 R56.1 R58.1)
VCC_1V8: Power Manager (6 pins), SOC POWER CAPS & SOC VSS (5 pins)
VCC_3V3_SYS: Power Manager (8 pins), SOC-Bootstrap (R33.2 R34.2), SOC POWER CAPS & SOC VSS (11 pins), SoC GPIO 3.3V (R43.2 R44.2 R45.2 R46.2)
VCC_CORE: Power Manager (5 pins), SOC POWER CAPS & SOC VSS (16 pins)
VDD_1V2: Power Manager (C31.2 IC1.24 L3.2 TP5.1), DDR4 Interface (39 pins), SOC POWER CAPS & SOC VSS (6 pins)
VDD_2V5: Power Manager (C37.1 IC1.23 TP7.1), DDR4 Interface (FL1.2)
VDDA1V8: Power Manager (C36.1 IC1.21), SOC POWER CAPS & SOC VSS (C126.1)
I2C0_SCL: Power Manager (R22.1), SoC GPIO 3.3V (R46.1 R47.1)
I2C0_SDA: Power Manager (R23.1), SoC GPIO 3.3V (R45.1 U1.A16)
VPP_LDO_EN: Power Manager (R31.1 R32.1), SoC GPIO 3.3V (U1.F24)
VSEL_SD_SOC: Power Manager (IC1.12 R20.1), eMMC FLASH INTERFACE (U1.C17)